# EAGLE design final (EAGLE 9.6.2)
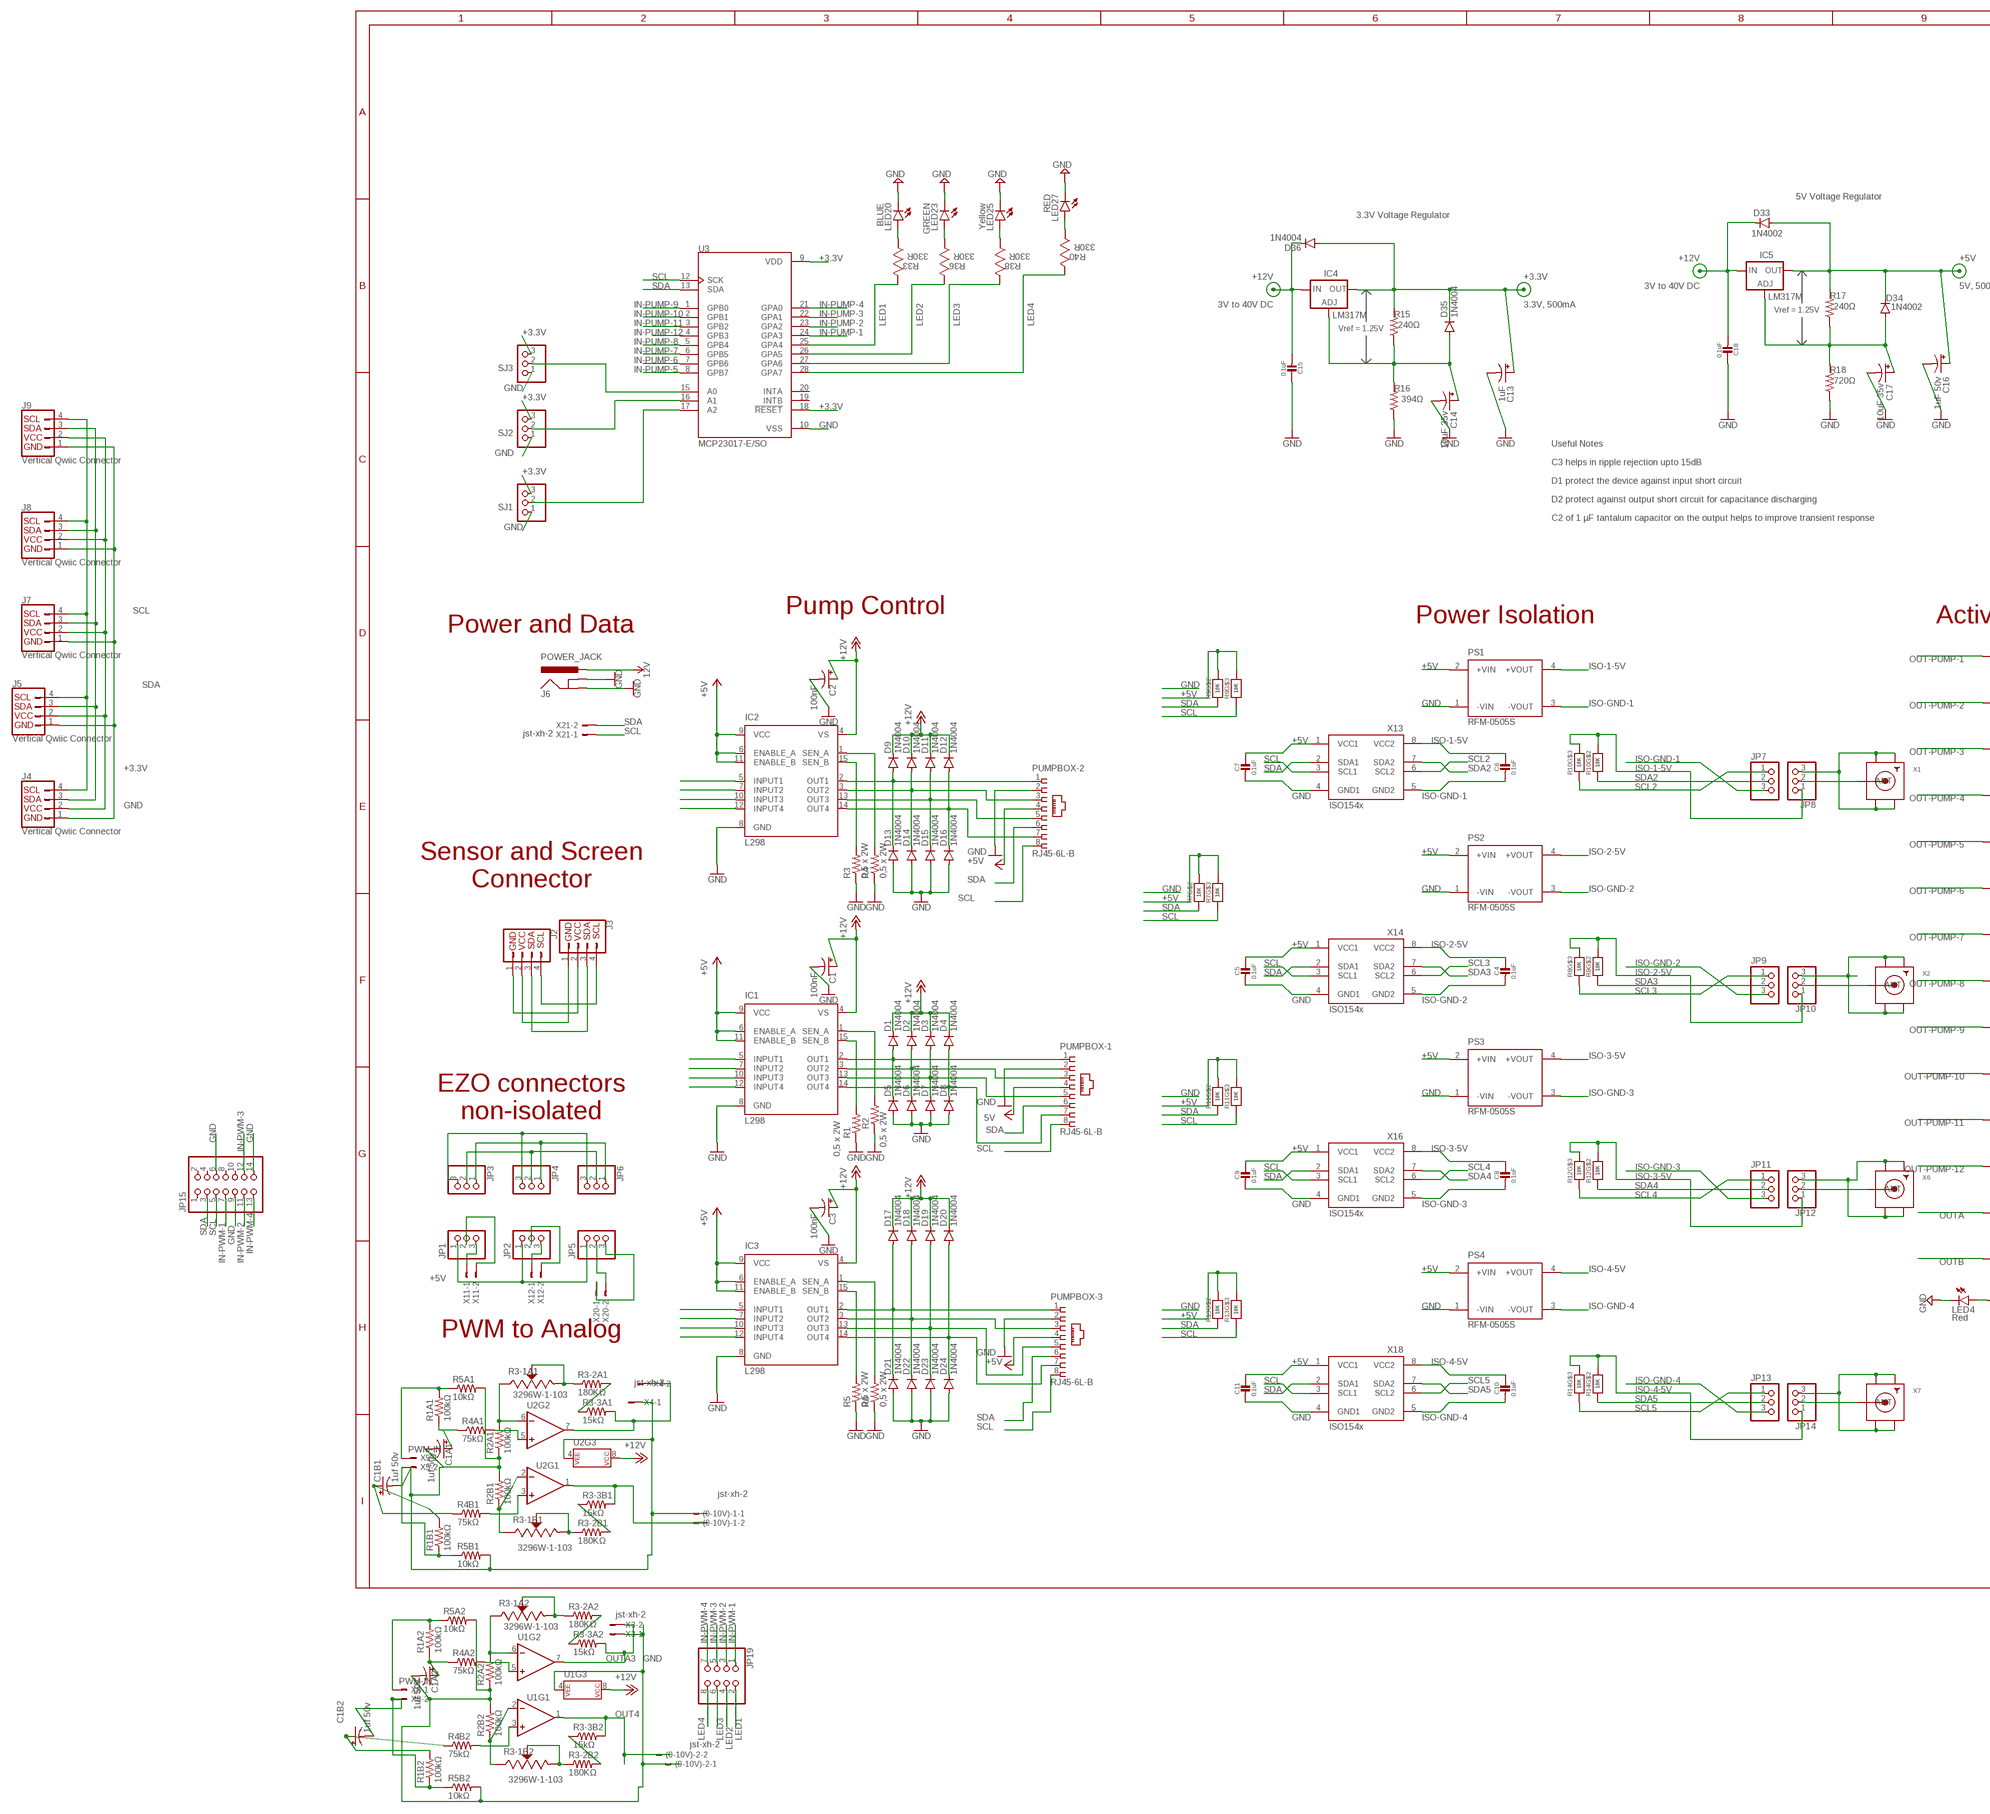
[diagram p0: schematic, sheet 1, part 1 of 2]
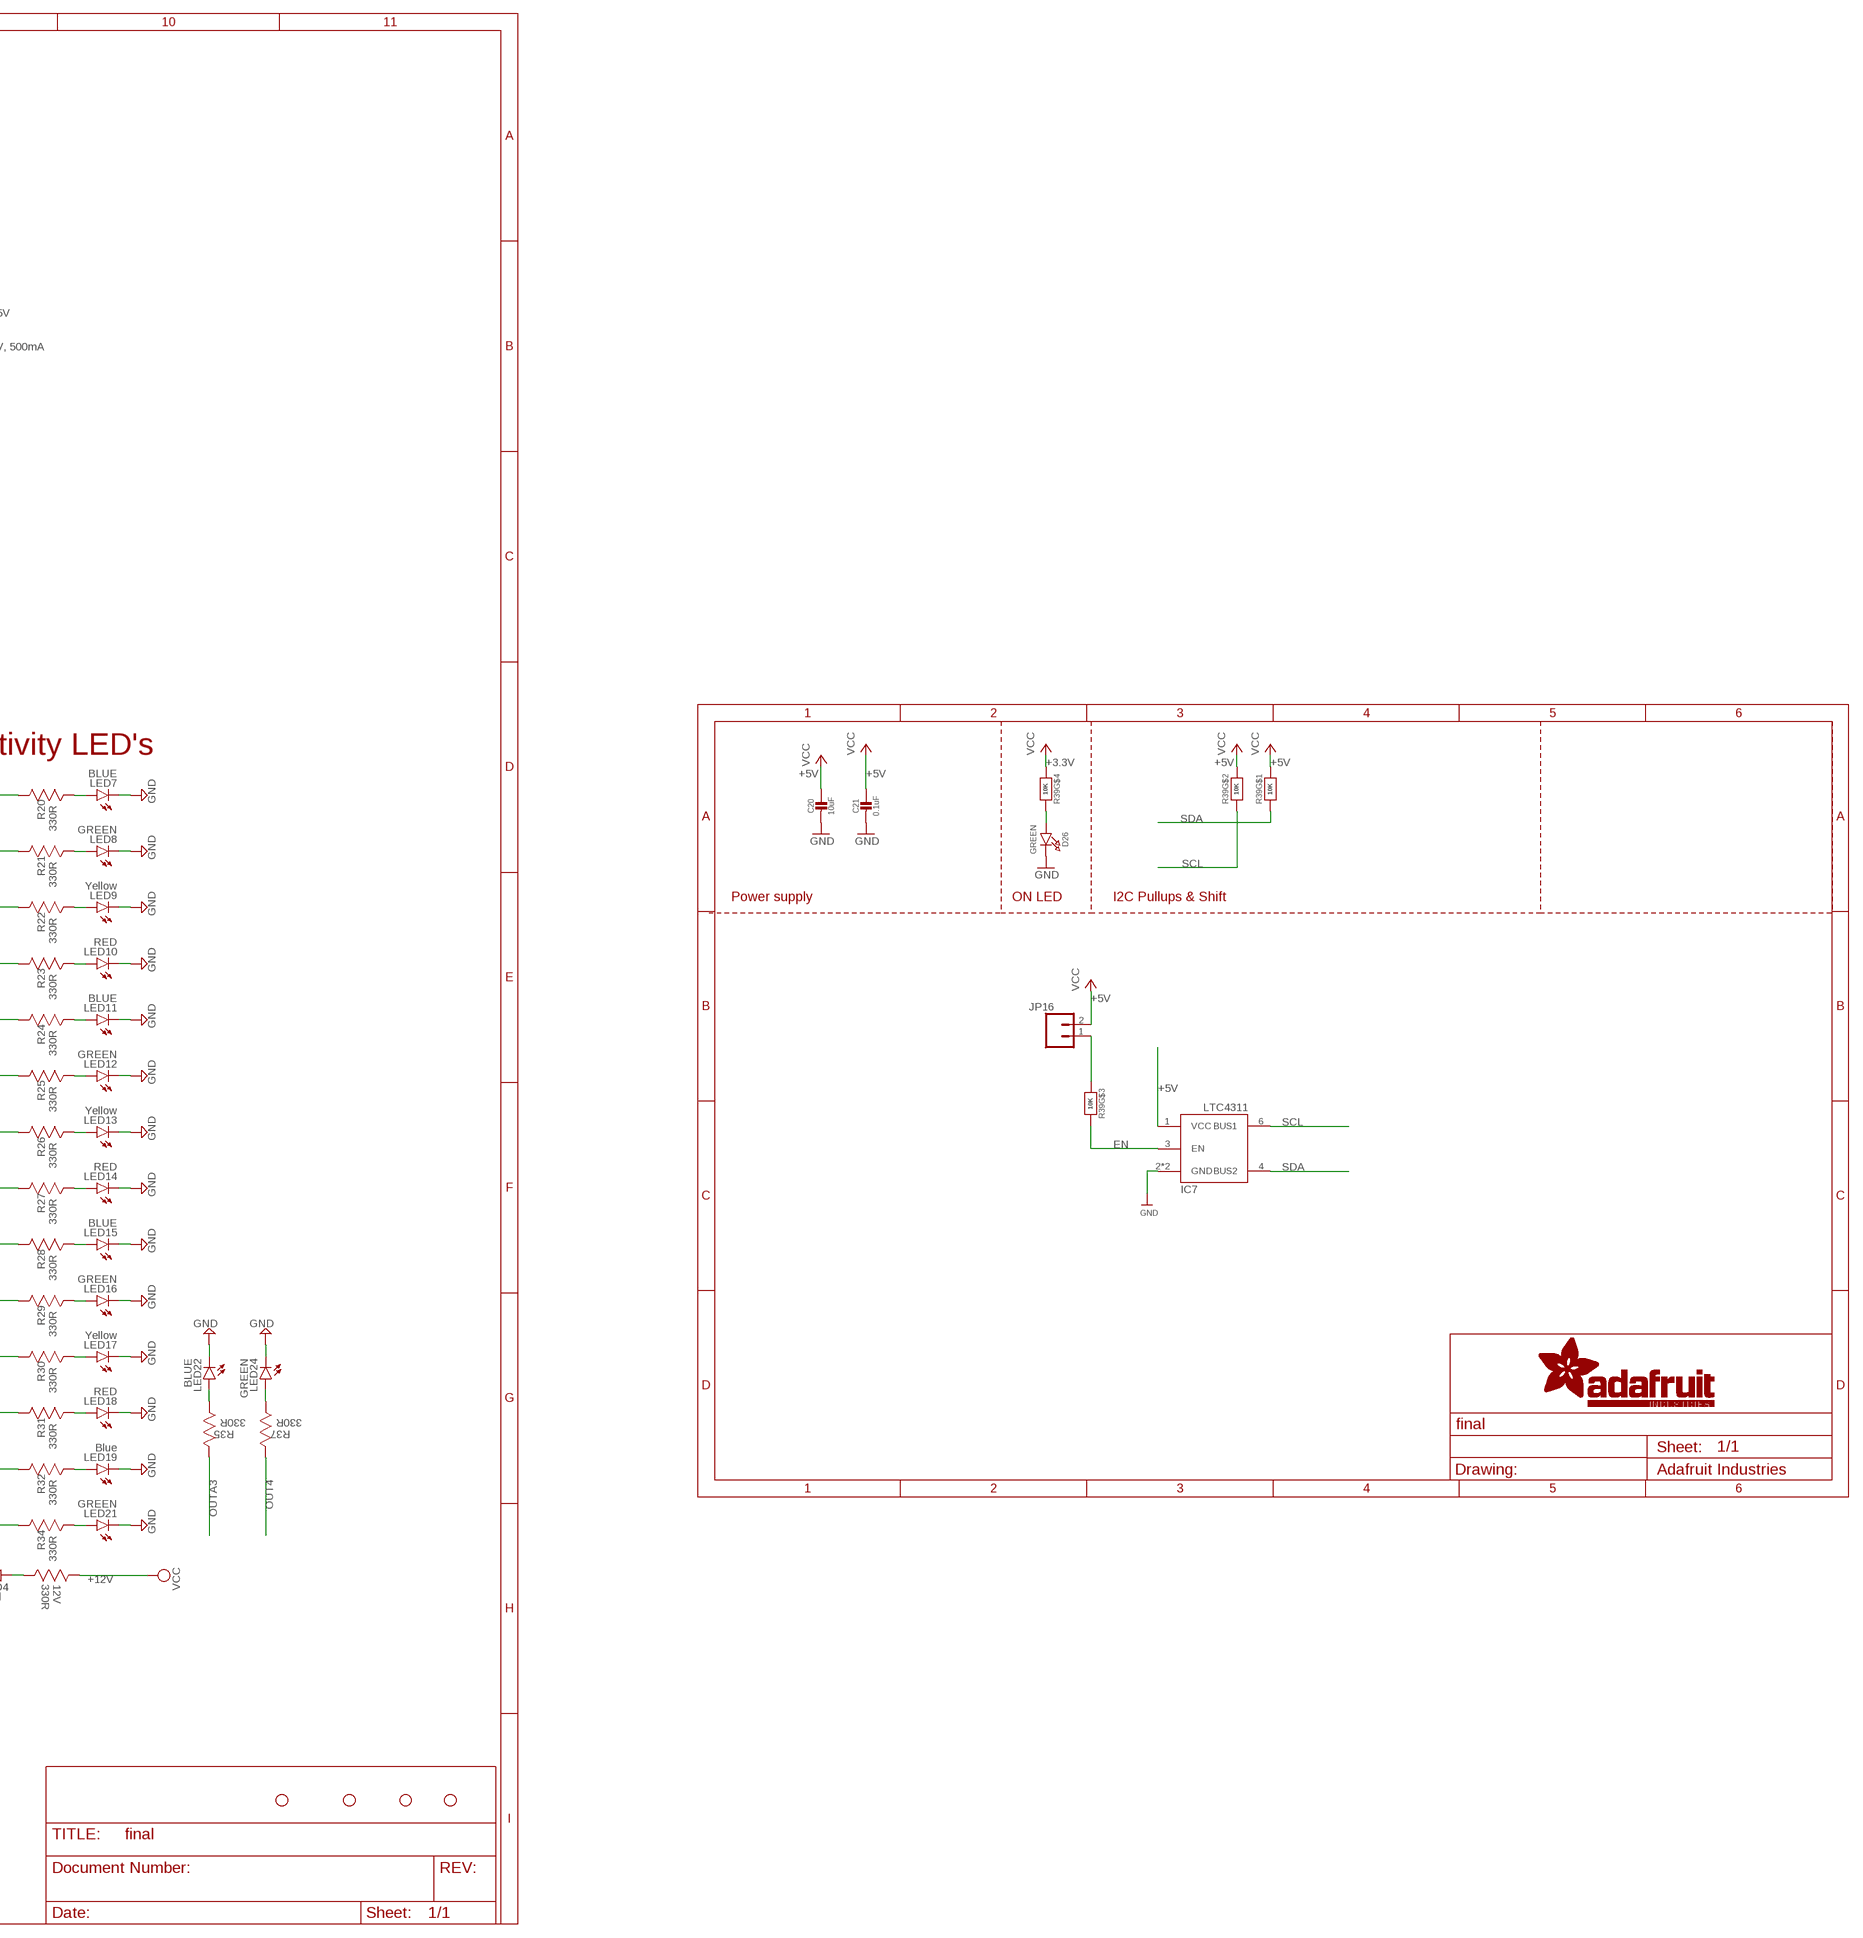
[diagram p1: schematic, sheet 1, part 2 of 2]

## Parts
12V  330R  MC0.063W06031%330R  [RESC1608X60N]
(0-10V)-1  jst-xh-2  JST-XH-02-PIN-LONG-PAD  [JST-XH-02-PACKAGE-LONG-PAD]
(0-10V)-2  jst-xh-2  JST-XH-02-PIN-LONG-PAD  [JST-XH-02-PACKAGE-LONG-PAD]
C1  100nF  CPOL-USUD-4X5,8  [UD-4X5,8_NICHICON]
C1A1  1uf 50v  CPOL-USUD-4X5,8  [UD-4X5,8_NICHICON]
C1A2  1uf 50v  CPOL-USUD-4X5,8  [UD-4X5,8_NICHICON]
C1B1  1uf 50v  CPOL-USUD-4X5,8  [UD-4X5,8_NICHICON]
C1B2  1uf 50v  CPOL-USUD-4X5,8  [UD-4X5,8_NICHICON]
C2  100nF  CPOL-USUD-4X5,8  [UD-4X5,8_NICHICON]
C3  100nF  CPOL-USUD-4X5,8  [UD-4X5,8_NICHICON]
C4  0.1uF  CAP_CERAMIC0603_NO  [0603-NO]
C5  0.1uF  CAP_CERAMIC0603_NO  [0603-NO]
C6  0.1uF  CAP_CERAMIC0603_NO  [0603-NO]
C7  0.1uF  CAP_CERAMIC0603_NO  [0603-NO]
C8  0.1uF  CAP_CERAMIC0603_NO  [0603-NO]
C9  0.1uF  CAP_CERAMIC0603_NO  [0603-NO]
C10  0.1uF  CAP_CERAMIC0603_NO  [0603-NO]
C11  0.1uF  CAP_CERAMIC0603_NO  [0603-NO]
C13  1uF  CPOL-USUD-4X5,8  [UD-4X5,8_NICHICON]
C14  10uF 35v  CPOL-USUD-4X5,8  [UD-4X5,8_NICHICON]
C15  0.1uF  CAP_CERAMIC0603_NO  [0603-NO]
C16  1uF 50v  CPOL-USUD-4X5,8  [UD-4X5,8_NICHICON]
C17  10uF 35v  CPOL-USUD-4X5,8  [UD-4X5,8_NICHICON]
C18  0.1uF  CAP_CERAMIC0603_NO  [0603-NO]
C20  10uF  CAP_CERAMIC0805-NOOUTLINE  [0805-NO]
C21  0.1uF  CAP_CERAMIC0603_NO  [0603-NO]
D1  1N4004  DIODE-DO214BA  [DO214BA]
D2  1N4004  DIODE-DO214BA  [DO214BA]
D3  1N4004  DIODE-DO214BA  [DO214BA]
D4  1N4004  DIODE-DO214BA  [DO214BA]
D5  1N4004  DIODE-DO214BA  [DO214BA]
D6  1N4004  DIODE-DO214BA  [DO214BA]
D7  1N4004  DIODE-DO214BA  [DO214BA]
D8  1N4004  DIODE-DO214BA  [DO214BA]
D9  1N4004  DIODE-DO214BA  [DO214BA]
D10  1N4004  DIODE-DO214BA  [DO214BA]
D11  1N4004  DIODE-DO214BA  [DO214BA]
D12  1N4004  DIODE-DO214BA  [DO214BA]
D13  1N4004  DIODE-DO214BA  [DO214BA]
D14  1N4004  DIODE-DO214BA  [DO214BA]
D15  1N4004  DIODE-DO214BA  [DO214BA]
D16  1N4004  DIODE-DO214BA  [DO214BA]
D17  1N4004  DIODE-DO214BA  [DO214BA]
D18  1N4004  DIODE-DO214BA  [DO214BA]
D19  1N4004  DIODE-DO214BA  [DO214BA]
D20  1N4004  DIODE-DO214BA  [DO214BA]
D21  1N4004  DIODE-DO214BA  [DO214BA]
D22  1N4004  DIODE-DO214BA  [DO214BA]
D23  1N4004  DIODE-DO214BA  [DO214BA]
D24  1N4004  DIODE-DO214BA  [DO214BA]
D26  GREEN  LED0603_NOOUTLINE  [CHIPLED_0603_NOOUTLINE]
D33  1N4002  DIODE-DO214BA  [DO214BA]
D34  1N4002  DIODE-DO214BA  [DO214BA]
D35  1N4004  DIODE-DO214BA  [DO214BA]
D36  1N4004  DIODE-DO214BA  [DO214BA]
H5  STAND-OFF  [STAND-OFF]
H6  STAND-OFF  [STAND-OFF]
H7  STAND-OFF  [STAND-OFF]
H8  STAND-OFF  [STAND-OFF]
IC1  L298  [MULTIWATT-15]
IC2  L298  [MULTIWATT-15]
IC3  L298  [MULTIWATT-15]
IC4  LM317MBSTT3  [SOT223]
IC5  LM317MBSTT3  [SOT223]
IC7  LTC4311_SC70  [SC70-6L]
J2  I2C_STANDARD  [1X04]
J3  I2C_STANDARD  [1X04]
J4  Vertical Qwiic Connector  QWIIC_CONNECTOR  [JST04_1MM_VERT]
J5  Vertical Qwiic Connector  QWIIC_CONNECTOR  [JST04_1MM_VERT]
J6  POWER_JACK  [POWER_JACK_PTH]
J7  Vertical Qwiic Connector  QWIIC_CONNECTOR  [JST04_1MM_VERT]
J8  Vertical Qwiic Connector  QWIIC_CONNECTOR  [JST04_1MM_VERT]
J9  Vertical Qwiic Connector  QWIIC_CONNECTOR  [JST04_1MM_VERT]
JP1  PINHD-1X3CB  [1X03-CLEANBIG]
JP2  PINHD-1X3CB  [1X03-CLEANBIG]
JP3  PINHD-1X3CB  [1X03-CLEANBIG]
JP4  PINHD-1X3CB  [1X03-CLEANBIG]
JP5  PINHD-1X3CB  [1X03-CLEANBIG]
JP6  PINHD-1X3CB  [1X03-CLEANBIG]
JP7  PINHD-1X3CB  [1X03-CLEANBIG]
JP8  PINHD-1X3CB  [1X03-CLEANBIG]
JP9  PINHD-1X3CB  [1X03-CLEANBIG]
JP10  PINHD-1X3CB  [1X03-CLEANBIG]
JP11  PINHD-1X3CB  [1X03-CLEANBIG]
JP12  PINHD-1X3CB  [1X03-CLEANBIG]
JP13  PINHD-1X3CB  [1X03-CLEANBIG]
JP14  PINHD-1X3CB  [1X03-CLEANBIG]
JP15  PINHD-2X7  [2X07]
JP16  CONN_02  [1X02]
JP19  PINHD-2X4  [2X04]
LED4  Red  LED-RED-0603-WE  [LED-0603]
LED7  BLUE  LED-BLUE0603  [LED-0603]
LED8  GREEN  LED-GREEN0603  [LED-0603]
LED9  Yellow  LED-YELLOW-0603-WE  [LED-0603]
LED10  RED  LED-RED0603  [LED-0603]
LED11  BLUE  LED-BLUE0603  [LED-0603]
LED12  GREEN  LED-GREEN0603  [LED-0603]
LED13  Yellow  LED-YELLOW0603  [LED-0603]
LED14  RED  LED-RED0603  [LED-0603]
LED15  BLUE  LED-BLUE0603  [LED-0603]
LED16  GREEN  LED-GREEN0603  [LED-0603]
LED17  Yellow  LED-YELLOW0603  [LED-0603]
LED18  RED  LED-RED0603  [LED-0603]
LED19  Blue  LED-BLUE-0603-WE  [LED-0603]
LED20  BLUE  LED-BLUE0603  [LED-0603]
LED21  GREEN  LED-GREEN0603  [LED-0603]
LED22  BLUE  LED-BLUE0603  [LED-0603]
LED23  GREEN  LED-GREEN0603  [LED-0603]
LED24  GREEN  LED-GREEN0603  [LED-0603]
LED25  Yellow  LED-YELLOW0603  [LED-0603]
LED27  RED  LED-RED0603  [LED-0603]
PS1  RFM-0505S  [CONV_RFM-0505S]
PS2  RFM-0505S  [CONV_RFM-0505S]
PS3  RFM-0505S  [CONV_RFM-0505S]
PS4  RFM-0505S  [CONV_RFM-0505S]
PUMPBOX-1  RJ45-6L-B  [RJ45-NO-SHIELD]
PUMPBOX-2  RJ45-6L-B  [RJ45-NO-SHIELD]
PUMPBOX-3  RJ45-6L-B  [RJ45-NO-SHIELD]
R1  0,5 x 2W  R-US_R2512  [R2512]
R1A1  100kΩ  R-US_M1206  [M1206]
R1A2  100kΩ  R-US_M1206  [M1206]
R1B1  100kΩ  R-US_M1206  [M1206]
R1B2  100kΩ  R-US_M1206  [M1206]
R2  0,5 x 2W  R-US_R2512  [R2512]
R2A1  100kΩ  R-US_M1206  [M1206]
R2A2  100kΩ  R-US_M1206  [M1206]
R2B1  100kΩ  R-US_M1206  [M1206]
R2B2  100kΩ  R-US_M1206  [M1206]
R3  0,5 x 2W  R-US_R2512  [R2512]
R3-1A1  3296W-1-103  [TRIM_3296W-1-103]
R3-1A2  3296W-1-103  [TRIM_3296W-1-103]
R3-1B1  3296W-1-103  [TRIM_3296W-1-103]
R3-1B2  3296W-1-103  [TRIM_3296W-1-103]
R3-2A1  180KΩ  R-US_M1206  [M1206]
R3-2A2  180KΩ  R-US_M1206  [M1206]
R3-2B1  180KΩ  R-US_M1206  [M1206]
R3-2B2  180KΩ  R-US_M1206  [M1206]
R3-3A1  15kΩ  R-US_M1206  [M1206]
R3-3A2  15kΩ  R-US_M1206  [M1206]
R3-3B1  15kΩ  R-US_M1206  [M1206]
R3-3B2  15kΩ  R-US_M1206  [M1206]
R4  0,5 x 2W  R-US_R2512  [R2512]
R4A1  75kΩ  R-US_M1206  [M1206]
R4A2  75kΩ  R-US_M1206  [M1206]
R4B1  75kΩ  R-US_M1206  [M1206]
R4B2  75kΩ  R-US_M1206  [M1206]
R5  0,5 x 2W  R-US_R2512  [R2512]
R5A1  10kΩ  R-US_M1206  [M1206]
R5A2  10kΩ  R-US_M1206  [M1206]
R5B1  10kΩ  R-US_M1206  [M1206]
R5B2  10kΩ  R-US_M1206  [M1206]
R6  0,5 x 2W  R-US_R2512  [R2512]
R7  10K  RESISTOR_4PACK  [RESPACK_4X0603]
R8  10K  RESISTOR_4PACK  [RESPACK_4X0603]
R9  10K  RESISTOR_4PACK  [RESPACK_4X0603]
R10  10K  RESISTOR_4PACK  [RESPACK_4X0603]
R11  10K  RESISTOR_4PACK  [RESPACK_4X0603]
R12  10K  RESISTOR_4PACK  [RESPACK_4X0603]
R13  10K  RESISTOR_4PACK  [RESPACK_4X0603]
R14  10K  RESISTOR_4PACK  [RESPACK_4X0603]
R15  240Ω  R-US_M0805  [M0805]
R16  394Ω  R-US_M0805  [M0805]
R17  240Ω  R-US_M0805  [M0805]
R18  720Ω  R-US_M0805  [M0805]
R20  330R  MC0.063W06031%330R  [RESC1608X60N]
R21  330R  MC0.063W06031%330R  [RESC1608X60N]
R22  330R  MC0.063W06031%330R  [RESC1608X60N]
R23  330R  MC0.063W06031%330R  [RESC1608X60N]
R24  330R  MC0.063W06031%330R  [RESC1608X60N]
R25  330R  MC0.063W06031%330R  [RESC1608X60N]
R26  330R  MC0.063W06031%330R  [RESC1608X60N]
R27  330R  MC0.063W06031%330R  [RESC1608X60N]
R28  330R  MC0.063W06031%330R  [RESC1608X60N]
R29  330R  MC0.063W06031%330R  [RESC1608X60N]
R30  330R  MC0.063W06031%330R  [RESC1608X60N]
R31  330R  MC0.063W06031%330R  [RESC1608X60N]
R32  330R  MC0.063W06031%330R  [RESC1608X60N]
R33  330R  MC0.063W06031%330R  [RESC1608X60N]
R34  330R  MC0.063W06031%330R  [RESC1608X60N]
R35  330R  MC0.063W06031%330R  [RESC1608X60N]
R36  330R  MC0.063W06031%330R  [RESC1608X60N]
R37  330R  MC0.063W06031%330R  [RESC1608X60N]
R38  330R  MC0.063W06031%330R  [RESC1608X60N]
R39  10K  RESISTOR_4PACK  [RESPACK_4X0603]
R40  330R  MC0.063W06031%330R  [RESC1608X60N]
SJ1  PINHD-1X3  [1X03]
SJ2  PINHD-1X3  [1X03]
SJ3  PINHD-1X3  [1X03]
U1  LM358  LM358SOI8  [SO08]
U2  LM358  LM358SOI8  [SO08]
U3  MCP23017-E/SO  [SOIC127P1030X265-28N]
X1  SMACONNECTOR_EDGE  [SMA_EDGELAUNCH]
X2  SMACONNECTOR_EDGE  [SMA_EDGELAUNCH]
X3  jst-xh-2  JST-XH-02-PIN-LONG-PAD  [JST-XH-02-PACKAGE-LONG-PAD]
X4  jst-xh-2  JST-XH-02-PIN-LONG-PAD  [JST-XH-02-PACKAGE-LONG-PAD]
X5  PWM-IN  JST-XH-02-PIN-LONG-PAD  [JST-XH-02-PACKAGE-LONG-PAD]
X6  SMACONNECTOR_EDGE  [SMA_EDGELAUNCH]
X7  SMACONNECTOR_EDGE  [SMA_EDGELAUNCH]
X8  PWM-IN  JST-XH-02-PIN-LONG-PAD  [JST-XH-02-PACKAGE-LONG-PAD]
X11  jst-xh-2  JST-XH-02-PIN-LONG-PAD  [JST-XH-02-PACKAGE-LONG-PAD]
X12  jst-xh-2  JST-XH-02-PIN-LONG-PAD  [JST-XH-02-PACKAGE-LONG-PAD]
X13  ISO154X  [SOIC8_150MIL]
X14  ISO154X  [SOIC8_150MIL]
X16  ISO154X  [SOIC8_150MIL]
X18  ISO154X  [SOIC8_150MIL]
X20  jst-xh-2  JST-XH-02-PIN-LONG-PAD  [JST-XH-02-PACKAGE-LONG-PAD]
X21  jst-xh-2  JST-XH-02-PIN-LONG-PAD  [JST-XH-02-PACKAGE-LONG-PAD]

## Nets
12V: J6.PWR
+3.3V [3.3v]: C13.+ D35.C D36.A IC4.4(OUT) J4.2 J5.2 J7.2 J8.2 J9.2 R15.2 R39.4 SJ1.3 SJ2.3 SJ3.3 U3.9(VDD) U3.18(!RESET) ; supply symbol labelled VCC
+5V [5v]: C5.1 C7.1 C9.1 C11.1 C16.+ C20.1 C21.1 D33.A D34.C IC1.6(ENABLE_A) IC1.9(VCC) IC1.11(ENABLE_B) IC2.6(ENABLE_A) IC2.9(VCC) IC2.11(ENABLE_B) IC3.6(ENABLE_A) IC3.9(VCC) IC3.11(ENABLE_B) IC5.4(OUT) IC7.1(VCC) J2.1 J3.2 JP1.1 JP2.1 JP5.1 JP16.2 PS1.2(+VIN) PS2.2(+VIN) PS3.2(+VIN) PS4.2(+VIN) PUMPBOX-1.4 PUMPBOX-2.4 PUMPBOX-3.4 R7.6 R7.7 R9.6 R9.7 R11.6 R11.7 R13.6 R13.7 R17.2 R39.7 R39.8 X13.1(VCC1) X14.1(VCC1) X16.1(VCC1) X18.1(VCC1) ; supply symbol labelled +3V3, VCC
+12V [12v]: 12V.1(R1) C1.+ C2.+ C3.+ C15.2 C18.2 D1.C D2.C D3.C D4.C D9.C D10.C D11.C D12.C D17.C D18.C D19.C D20.C D33.C D36.C IC1.4(VS) IC2.4(VS) IC3.4(VS) IC4.3(IN) IC5.3(IN) U1.8(P$V+) U2.8(P$V+) ; supply symbol labelled VCC
EN: IC7.3(EN) R39.6
GND: (0-10V)-1.1 (0-10V)-2.1 C1.- C1A1.- C1A2.- C1B1.- C2.- C3.- C5.2 C7.2 C9.2 C11.2 C13.- C14.- C15.1 C16.- C17.- C18.1 C20.2 C21.2 D5.A D6.A D7.A D8.A D13.A D14.A D15.A D16.A D21.A D22.A D23.A D24.A D26.C IC1.8(GND) IC2.8(GND) IC3.8(GND) IC7.2(GND) IC7.5(GND) J2.2 J3.1 J4.1 J5.1 J6.GND J6.GNDBREAK J7.1 J8.1 J9.1 JP3.3 JP4.3 JP6.3 JP15.6 JP15.9 JP15.14 LED4.C LED7.C LED8.C LED9.C LED10.C LED11.C LED12.C LED13.C LED14.C LED15.C LED16.C LED17.C LED18.C LED19.C LED20.C LED21.C LED22.C LED23.C LED24.C LED25.C LED27.C PS1.1(-VIN) PS2.1(-VIN) PS3.1(-VIN) PS4.1(-VIN) PUMPBOX-1.2 PUMPBOX-2.2 PUMPBOX-3.2 R1.1 R2.1 R2A1.1 R2A2.1 R2B1.2 R2B2.2 R3.1 R4.1 R5.1 R5A1.2 R5A2.2 R5B1.2 R5B2.2 R6.1 R16.1 R18.1 SJ1.1 SJ2.1 SJ3.1 U1.4(P$V-) U2.4(P$V-) U3.10(VSS) X3.1 X4.1 X13.4(GND1) X14.4(GND1) X16.4(GND1) X18.4(GND1)
IN-PUMP-1: IC1.5(INPUT1) U3.24(GPA3)
IN-PUMP-2: IC1.7(INPUT2) U3.23(GPA2)
IN-PUMP-3: IC1.10(INPUT3) U3.22(GPA1)
IN-PUMP-4: IC1.12(INPUT4) U3.21(GPA0)
IN-PUMP-5 [GPIO]: IC2.5(INPUT1) U3.8(GPB7)
IN-PUMP-6 [GPIO]: IC2.7(INPUT2) U3.7(GPB6)
IN-PUMP-7 [GPIO]: IC2.10(INPUT3) U3.6(GPB5)
IN-PUMP-8 [GPIO]: IC2.12(INPUT4) U3.5(GPB4)
IN-PUMP-9 [GPIO]: IC3.5(INPUT1) U3.1(GPB0)
IN-PUMP-10 [GPIO]: IC3.7(INPUT2) U3.2(GPB1)
IN-PUMP-11 [GPIO]: IC3.10(INPUT3) U3.3(GPB2)
IN-PUMP-12 [GPIO]: IC3.12(INPUT4) U3.4(GPB3)
IN-PWM-1: JP15.7 JP19.1 R1A1.2 R5A1.1 X5.1
IN-PWM-2: JP15.11 JP19.3 R1B1.1 R5B1.1 X5.2
IN-PWM-3: JP15.12 JP19.5 R1A2.2 R5A2.1 X8.1
IN-PWM-4: C1B2.- JP15.13 JP19.7 R1B2.1 R5B2.1 X8.2
ISO-1-5V: C6.1 JP8.1 PS1.4(+VOUT) R10.6 R10.7 X13.8(VCC2)
ISO-2-5V: C4.1 JP10.1 PS2.4(+VOUT) R8.6 R8.7 X14.8(VCC2)
ISO-3-5V: C8.1 JP12.1 PS3.4(+VOUT) R12.6 R12.7 X16.8(VCC2)
ISO-4-5V: C10.1 JP14.1 PS4.4(+VOUT) R14.6 R14.7 X18.8(VCC2)
ISO-GND-1: C6.2 JP7.3 PS1.3(-VOUT) X13.5(GND2)
ISO-GND-2: C4.2 JP9.3 PS2.3(-VOUT) X14.5(GND2)
ISO-GND-3: C8.2 JP11.3 PS3.3(-VOUT) X16.5(GND2)
ISO-GND-4: C10.2 JP13.3 PS4.3(-VOUT) X18.5(GND2)
LED1: JP19.2 R33.1(R1) U3.25(GPA4)
LED2: JP19.4 R36.1(R1) U3.26(GPA5)
LED3: JP19.6 R38.1(R1) U3.27(GPA6)
LED4: JP19.8 R40.1(R1) U3.28(GPA7)
N$1: IC2.1(SEN_A) R4.2
N$2: IC2.15(SEN_B) R3.2
N$3: IC3.1(SEN_A) R6.2
N$4: IC3.15(SEN_B) R5.2
N$5: C14.+ D35.A IC4.1(ADJ) R15.1 R16.2
N$6: R3-1B2.2(WIPER) R3-1B2.3(CW) R3-2B2.1
N$7: LED20.A R33.2(R2)
N$8: R3-2B2.2 R3-3B2.1
N$9: IC1.1(SEN_A) R2.2
N$10: IC1.15(SEN_B) R1.2
N$11: C17.+ D34.A IC5.1(ADJ) R17.1 R18.2
N$12: JP12.3 X6.GND@1(GND4) X6.GND@2(GND3) X6.GND@3(GND2) X6.GND@4(GND1)
N$13: LED23.A R36.2(R2)
N$14: JP8.3 X1.GND@1(GND4) X1.GND@2(GND3) X1.GND@3(GND2) X1.GND@4(GND1)
N$15: JP10.3 X2.GND@1(GND4) X2.GND@2(GND3) X2.GND@3(GND2) X2.GND@4(GND1)
N$16: JP8.2 X1.P(ANT)
N$17: R3-1B1.2(WIPER) R3-1B1.3(CW) R3-2B1.1
N$18: R3-2B1.2 R3-3B1.1
N$19: R3-1A1.2(WIPER) R3-1A1.3(CW) R3-2A1.1
N$20: R3-2A1.2 R3-3A1.1
N$21: C1A1.+ R1A1.1 R4A1.1
N$22: C1B1.+ R1B1.2 R4B1.1
N$23: R2A1.2 R3-1A1.1(CCW) U2.6(-IN)
N$24: R2B1.1 R3-1B1.1(CCW) U2.2(-IN)
N$25: R4A1.2 U2.5(+IN)
N$26: R4B1.2 U2.3(+IN)
N$27: C1B2.+ R1B2.2 R4B2.1
N$28: LED22.A R35.2(R2)
N$29: LED24.A R37.2(R2)
N$30: JP14.3 X7.GND@1(GND4) X7.GND@2(GND3) X7.GND@3(GND2) X7.GND@4(GND1)
N$31: JP5.2 X20.2
N$32: JP10.2 X2.P(ANT)
N$33: JP5.3 X20.1
N$34: JP2.3 X12.1
N$35: JP2.2 X12.2
N$36: JP12.2 X6.P(ANT)
N$37: JP1.3 X11.1
N$38: JP1.2 X11.2
N$40: JP14.2 X7.P(ANT)
N$41: D26.A R39.5
N$42: JP16.1 R39.3
N$47: 12V.2(R2) LED4.A
N$50 [GPIO]: LED7.A R20.2(R2)
N$51 [GPIO]: LED8.A R21.2(R2)
N$52 [GPIO]: LED9.A R22.2(R2)
N$53 [GPIO]: LED10.A R23.2(R2)
N$54 [GPIO]: LED11.A R24.2(R2)
N$55 [GPIO]: LED12.A R25.2(R2)
N$56 [GPIO]: LED13.A R26.2(R2)
N$57 [GPIO]: LED14.A R27.2(R2)
N$58 [GPIO]: LED15.A R28.2(R2)
N$59 [GPIO]: LED16.A R29.2(R2)
N$60 [GPIO]: LED17.A R30.2(R2)
N$61 [GPIO]: LED18.A R31.2(R2)
N$62 [GPIO]: LED19.A R32.2(R2)
N$63: R3-1A2.2(WIPER) R3-1A2.3(CW) R3-2A2.1
N$64 [GPIO]: LED21.A R34.2(R2)
N$65: LED25.A R38.2(R2)
N$66: R3-2A2.2 R3-3A2.1
N$67: LED27.A R40.2(R2)
N$68: C1A2.+ R1A2.1 R4A2.1
N$70: R2A2.2 R3-1A2.1(CCW) U1.6(-IN)
N$71: R2B2.1 R3-1B2.1(CCW) U1.2(-IN)
N$72: R4A2.2 U1.5(+IN)
N$73: R4B2.2 U1.3(+IN)
N$74: SJ3.2 U3.15(A0)
N$75: SJ2.2 U3.16(A1)
N$76: SJ1.2 U3.17(A2)
OUT4: (0-10V)-2.2 R3-3B2.2 R37.1(R1) U1.1(OUT)
OUT-PUMP-1 [highpower]: D1.A D5.C IC1.2(OUT1) PUMPBOX-1.1 R20.1(R1)
OUT-PUMP-2 [highpower]: D2.A D6.C IC1.3(OUT2) PUMPBOX-1.3 R21.1(R1)
OUT-PUMP-3 [highpower]: D3.A D7.C IC1.13(OUT3) PUMPBOX-1.5 R22.1(R1)
OUT-PUMP-4 [highpower]: D4.A D8.C IC1.14(OUT4) PUMPBOX-1.7 R23.1(R1)
OUT-PUMP-5 [highpower]: D9.A D13.C IC2.2(OUT1) PUMPBOX-2.1 R24.1(R1)
OUT-PUMP-6 [highpower]: D10.A D14.C IC2.3(OUT2) PUMPBOX-2.3 R25.1(R1)
OUT-PUMP-7 [highpower]: D11.A D15.C IC2.13(OUT3) PUMPBOX-2.5 R26.1(R1)
OUT-PUMP-8 [highpower]: D12.A D16.C IC2.14(OUT4) PUMPBOX-2.7 R27.1(R1)
OUT-PUMP-9 [highpower]: D17.A D21.C IC3.2(OUT1) PUMPBOX-3.1 R28.1(R1)
OUT-PUMP-10 [highpower]: D18.A D22.C IC3.3(OUT2) PUMPBOX-3.3 R29.1(R1)
OUT-PUMP-11 [highpower]: D19.A D23.C IC3.13(OUT3) PUMPBOX-3.5 R30.1(R1)
OUT-PUMP-12: D20.A D24.C IC3.14(OUT4) PUMPBOX-3.7 R31.1(R1)
OUTA: R3-3A1.2 R32.1(R1) U2.7(OUT) X4.2
OUTA3: R3-3A2.2 R35.1(R1) U1.7(OUT) X3.2
OUTB: (0-10V)-1.2 R3-3B1.2 R34.1(R1) U2.1(OUT)
SCL: IC7.6(BUS1) J2.3 J3.3 J4.4 J5.4 J7.4 J8.4 J9.4 JP3.1 JP4.1 JP6.1 JP15.5 PUMPBOX-1.8 PUMPBOX-2.8 PUMPBOX-3.8 R7.3 R9.3 R11.3 R13.3 R39.2 U3.12(SCK) X13.3(SCL1) X14.3(SCL1) X16.3(SCL1) X18.3(SCL1) X21.1
SCL2: JP7.1 R10.3 X13.6(SCL2)
SCL3: JP9.1 R8.3 X14.6(SCL2)
SCL4: JP11.1 R12.3 X16.6(SCL2)
SCL5: JP13.1 R14.3 X18.6(SCL2)
SDA: IC7.4(BUS2) J2.4 J3.4 J4.3 J5.3 J7.3 J8.3 J9.3 JP3.2 JP4.2 JP6.2 JP15.3 PUMPBOX-1.6 PUMPBOX-2.6 PUMPBOX-3.6 R7.2 R9.2 R11.2 R13.2 R39.1 U3.13(SDA) X13.2(SDA1) X14.2(SDA1) X16.2(SDA1) X18.2(SDA1) X21.2
SDA2: JP7.2 R10.2 X13.7(SDA2)
SDA3: JP9.2 R8.2 X14.7(SDA2)
SDA4: JP11.2 R12.2 X16.7(SDA2)
SDA5: JP13.2 R14.2 X18.7(SDA2)
Unconnected: JP15.1 JP15.2 JP15.4 JP15.8 JP15.10 R7.1 R7.4 R7.5 R7.8 R8.1 R8.4 R8.5 R8.8 R9.1 R9.4 R9.5 R9.8 R10.1 R10.4 R10.5 R10.8 R11.1 R11.4 R11.5 R11.8 R12.1 R12.4 R12.5 R12.8 R13.1 R13.4 R13.5 R13.8 R14.1 R14.4 R14.5 R14.8 U3.19(INTB) U3.20(INTA)

## Notes on the sheet
- 5V Voltage Regulator
- 3.3V Voltage Regulator
- 3V to 40V DC | 5V, 500mA
- 3V to 40V DC | 3.3V, 500mA
- Vref = 1.25V
- Vref = 1.25V
- Useful Notes
- C3 helps in ripple rejection upto 15dB
- D1 protect the device against input short circuit
- D2 protect against output short circuit for capacitance discharging
- C2 of 1 µF tantalum capacitor on the output helps to improve transient response
- Pump Control
- Power Isolation | Activity LED's
- Power and Data
- Power supply | ON LED | I2C Pullups & Shift
- Sensor and Screen
  Connector
- EZO connectors
  non-isolated
- PWM to Analog

## Library data of the parts
12V R20-R38 R40 = Multicomp:MC0.063W06031%330R: RESISTOR, 0603; MPN: MC0.063W06031%330R; OC_FARNELL: 9331018; OC_NEWARK: -; SUPPLIER: Multicomp; TOLERANCE: ±1%; VALUE: 330 Ohms; WATTAGE: 1/16 W
(0-10V)-1 (0-10V)-2 X3-X5 X8 X11 X12 X20 X21 = Rembrandt Electronics - JST XH Connectors v1-0:JST-XH-02-PIN: JST XH Connector 2 Pin Wire to board connector. Pitch: 2,54 mm, (0.100") Number of pins: 2 Created by Rembrandt Electronics www.rembrandtelectronics.com
C1 C1A1 C1A2 C1B1 C1B2 C2 C3 C13 C14 C16 C17 = rcl:CPOL-US: POLARIZED CAPACITOR, American symbol; SPICEPREFIX: C
C4-C11 C15 C18 C20 C21 = microbuilder:CAP_CERAMIC: Ceramic Capacitors For new designs, use the packages preceded by an '_' character since they are more reliable: The following footprints should be used on most boards: _0402 - Standard footprint for regular board layouts _0603 - Standard footprint for regular board layouts _0805 - Standard footprint for regular board layouts _1206 - Standard footprint for regular board layouts For extremely tight-pitch boards where space is at a premium, the following 'micro-pitch' footprints can be used (smaller pads, no silkscreen outline, etc.): _0402MP - Micro-pitch footprint for very dense/compact boards _0603MP - Micro-pitch footprint for very dense/compact boards _0805MP - Micro-pitch footprint for very dense/compact boards _1206MP - Micro-pitch footprint for very dense/compact boards
D1-D24 D33-D36 = diode:DIODE-: DIODE
D26 = microbuilder:LED: LED 0603 - 0603 Surface Mount Package 2mA: Green LED - Low Power (3.9mcd, 2ma, 1.7Vf) - Digikey: 475-2709-2-ND Orange LED - Low Power (9.8mcd, 2ma, 1.8Vf) - Digikey: 475-1194-2-ND Red LED - Low Power (5mcd, 2ma, 1.8Vf) - Digikey: 475-1195-2-ND Yellow LED - Low Power (7mcd, 2ma, 1.8Vf) - Digikey: 475-1196-2-ND 5mA: Blue LED - Low Power (17mcd, 5ma, 2.9Vf) - Digikey: LNJ937W8CRACT-ND 0805 - 0805 Surface Mount Package 2mA: Red LED (8.8mcd, 2mA, 1.8Vf, Clear) - Low Power [Digikey: 475-2510-1-ND] Green LED (5mcd, 2mA, 1.8Vf, Clear) - Low Power [Digikey: 475-2730-1-ND] Yellow LED (11.3mcd, 2mA, 1.8Vf, Clear) - Low Power [Digikey: 475-2555-1-ND] 20mA: Red LED (104mcd, 20mA, Diffused) - LS R976 [Digikey: 475-1278-6-ND] Red LED (12mcd, 20mA, 2.0Vf, Clear) - APT2012EC [Digikey: 754-1128-1-ND] Green LED (15mcd, 20mA, 2.2Vf, Clear) - APT2012GC [Digikey: 754-1131-1-ND] Orange LED (160mcd, 20mA, 2.1Vf, Clear) - APT2012SECK [Digikey: 754-1130-1-ND] 1206 - 1206 Surface Mount Package Green LED (26mcd, 20mA, Diffused) - LG N971 [Digikey: 475-1407-6-ND] Red LED (15mcd, 20mA, Diffused) - LH N974 [Digikey: 475-1416-6-ND] Cree - Cree High-Power Surface Mount LEDs XPEBWT-L1-0000-00D50 - White 111lm 350mA 2.9Vf 6200K 110° XTEAWT-00-0000-00000LEE3 - White 114lm 350mA 2.85Vf 5000K 115° Everlight - Everlight 45-21 Series Surface Mount LEDs 45-21/QK2C-B2832AC2CB2/2T - Warm White 2000mcd 20mA 3.25Vf 3050K 120° 45-21/LK2C-B38452C4CB2/2T - Nuetral White 2000mcd 20mA 3.25Vf 4150K 120° 45-21/LK2C-B50634C6CB2/2T - Cold White 2200mcd 20mA 3.25Vf 5650K 120° PLCC2 Reverse Mount LS T77K-J1L2-1-0-2-R18-Z - Red 11.25mcd 2mA 1.8Vf 630nm 120° LO T77K-L1M2-24-Z - Orange 19.6mcd 2mA 1.8Vf 606nm 120° LY T77K-K2M1-26-Z - Yellow 15.7mcd 2mA 1.8Vf 587nm 120°
H5-H8 = SparkFun-Hardware:STAND-OFF: Stand Off Drill holes for mechanically mounting via screws, standoffs, etc. Note: Use the keepout ring to avoid running the screw head into surrounding components. Variant Overviews STAND-OFF - Mechanical footprint for a #4 phillips button head screw. STAND-OFF-TIGHT - Mechanical footprint for a #4 phillips button head screw, Example SparkFun Products Screw - Phillips Head (1/4", 4-40, 10 pack) <https://www.sparkfun.com/products/10453> (PRT-10453) Screw - Phillips Head (1/2", 4-40, 10 pack) <https://www.sparkfun.com/products/10452> (PRT-10452) Screw - Phillips Head (3/4", 4-40, 10 pack) <https://www.sparkfun.com/products/10451> (PRT-10451) Screw - Phillips Head (1", 4-40, 10 pack) <https://www.sparkfun.com/products/10450> (PRT-10450)
IC1-IC3 = st-microelectronics:L298: DUAL FULL-BRIDGE DRIVER
IC4 IC5 = v-reg:LM317?*: 500 mA Adjustable Output Positive Voltage Regulator Source: http://www.onsemi.co.jp .. LM317M-D.PDF; PARTNUMBER: LM317M
IC7 = microbuilder:LTC4311
J2 J3 = SparkFun-Connectors:I2C_STANDARD: SparkFun I2C Standard Pinout Header SparkFun has standardized on a pinout for all I2C based sensor breakouts. This pinout allows I2C boards to be plugged directly into the headers on Arduino Uno compatible boards, and to be daisy chained easily. Example SparkFun Products: SparkFun Atmospheric Sensor Breakout - BME280 <https://www.sparkfun.com/products/13676> SparkFun Altitude/Pressure Sensor Breakout - MPL3115A2 <https://www.sparkfun.com/products/11084> SparkFun TOF Range Finder Sensor - VL6180 <https://www.sparkfun.com/products/12785>
J4 J5 J7-J9 = SparkFun-Connectors:QWIIC_CONNECTOR: SparkFun I2C Standard Qwiic Connector An SMD 1mm pitch JST connector makes it easy and quick (get it? Qwiic?) to connect I2C devices to each other. The Qwiic system <http://www.sparkfun.com/qwiic> enables fast and solderless connection between popular platforms and various sensors and actuators. We carry 200mm <https://www.sparkfun.com/products/14204>, 100mm <https://www.sparkfun.com/products/14205>, 50mm <https://www.sparkfun.com/products/14206>, and breadboard friendly <https://www.sparkfun.com/products/14207> Qwiic cables. We also offer 10 pcs strips <https://www.sparkfun.com/products/14323> the SMD connectors.; PROD_ID: CONN-14483
J6 = SparkFun-Connectors:POWER_JACK: Power Jack Connector This is the standard 5.5mm barrel jack for power. The PTH is the most common, proven, reliable, footprint. The Slot footprint only works if the mill layer is transmitted to the PCB fab house so be warned. Here are the connectors we sell at SparkFun: DC Barrel Power Jack/Connector <https://www.sparkfun.com/products/119> (PRT-00119) DC Barrel Power Jack/Connector (SMD) <https://www.sparkfun.com/products/12748> (PRT-12748) DC Barrel Jack Adapter - Breadboard Compatible <https://www.sparkfun.com/products/10811> (PRT-10811) It is used on this SparkFun product (and many, many others): SparkFun RedBoard - Programmed with Arduino <https://www.sparkfun.com/products/12757> (DEV-12757) Also, if you need a mating power supply or connector, please check these out: Wall Adapter Power Supply - 9VDC 650mA <https://www.sparkfun.com/products/298> (TOL-00298) DC Barrel Jack Adapter - Male <https://www.sparkfun.com/products/10287> (PRT-10287); PROD_ID: CONN-08197
JP1-JP14 SJ1-SJ3 = adafruit:PINHD-1X3: PIN HEADER
JP15 = pinhead:PINHD-2X7: PIN HEADER
JP16 = SparkFun-Connectors:CONN_02: Multi connection point. Often used as Generic Header-pin footprint for 0.1 inch spaced/style header connections On any of the 0.1 inch spaced packages, you can populate with these: Break Away Headers - Straight <https://www.sparkfun.com/products/116> (PRT-00116) Break Away Male Headers - Right Angle <https://www.sparkfun.com/products/553> (PRT-00553) Female Headers <https://www.sparkfun.com/products/115> (PRT-00115) Break Away Headers - Machine Pin <https://www.sparkfun.com/products/117> (PRT-00117) Break Away Female Headers - Swiss Machine Pin <https://www.sparkfun.com/products/743> (PRT-00743) For SCREWTERMINALS and SPRING TERMINALS visit here: Screw Terimnals on SparkFun.com <https://www.sparkfun.com/search/results?term=Screw+Terminals> (5mm/3.5mm/2.54mm spacing) This device is also useful as a general connection point to wire up your design to another part of your project. Our various solder wires solder well into these plated through hole pads. Hook-Up Wire - Assortment (Stranded, 22 AWG) <https://www.sparkfun.com/products/11375> (PRT-11375) Hook-Up Wire - Assortment (Solid Core, 22 AWG) <https://www.sparkfun.com/products/11367> (PRT-11367) View the entire wire category on our website here <https://www.sparkfun.com/categories/141> Special notes: Molex polarized connector foot print use with: PRT-08233 with associated crimp pins and housings. 2.54_SCREWTERM for use with PRT-10571. 3.5mm Screw Terminal footprints for PRT-08084 5mm Screw Terminal footprints for use with PRT-08432
JP19 = pinhead:PINHD-2X4: PIN HEADER
LED4 = SparkFun-LED:LED-RED: Red SMD LED Used in manufacturing of most products at SparkFun Packages: 0603 - SMD 0603 package [Product Link] <http://docs.avagotech.com/docs/AV02-0551EN> 0603 SMART - SMD 0603 SMART package ( more efficient and expensive)[Product Link] <http://www.osram-os.com/Graphics/XPic2/00077099_0.pdf> 1206 - SMD1206 package [Product Link] <https://www.sparkfun.com/datasheets/DevTools/LilyPad/Q150OVS4.pdff> SparkFun Products: Pro Mini 328 -5V <https://www.sparkfun.com/products/821> RedBoard <https://www.sparkfun.com/products/12757> IOIO-OTG <https://www.sparkfun.com/products/13613>; PROD_ID: DIO-16511
LED7 LED11 LED15 LED20 LED22 = SparkFun-LED:LED-BLUE: Blue SMD LED Used in manufacturing of various products at SparkFun Packages: 0603 - SMD 0603 package [Product Link] <http://www.digikey.com/product-detail/en/SMLE12BC7TT86/511-1589-2-ND/1641808> 1206 - SMD1206 package [Product Link] <http://www.digikey.com/product-detail/en/lite-on-inc/LTST-C150TBKT/160-1643-1-ND/573584> SparkFun Products: ESP8266 Thing-Dev Board <https://www.sparkfun.com/products/13711> RedBoard <https://www.sparkfun.com/products/12757>; PROD_ID: DIO-08575
LED8 LED12 LED16 LED21 LED23 LED24 = SparkFun-LED:LED-GREEN: Green SMD LED Used in manufacturing of various products at SparkFun Packages: 0603 - SMD 0603 package [Product Link] <http://www.futureelectronics.com/en/technologies/semiconductors/optoelectronics/leds/Pages/9894312-LTST-C190GKT.aspx?CrossPart=HSMG-C190&IM=0> LilyPad 1206 - SMD1206 LilyPad package [Product Link] <http://www.futureelectronics.com/en/Technologies/Product.aspx?ProductID=IN150NGHARVATEKCORPORATION2049943&IM=0> 1206 - SMD1206 package [Product Link] <http://www.futureelectronics.com/en/technologies/semiconductors/optoelectronics/leds/Pages/8315665-LTST-C150KGKT.aspx?IM=0> 1206 Bottom Mount -SMD 1206 Bottom Mount [Product Link] <http://www.digikey.com/product-detail/en/lite-on-inc/LTST-C230KGKT/160-1456-1-ND/386854> SparkFun Products: Pro Mini 328 -5V <https://www.sparkfun.com/products/821> RedBoard <https://www.sparkfun.com/products/12757> MP3 Trigger <https://www.sparkfun.com/products/13720> Makey Makey <https://www.sparkfun.com/products/11076>; PROD_ID: DIO-00821
LED9 = SparkFun-LED:LED-YELLOW: Yellow SMD LED Used in manufacturing several products at SparkFun. Packages: 0603 - SMD 0603 package[Product Link] <http://www.kingbrightusa.com/product.asp?catalog_name=LED&product_id=APT1608SYCK> 0603 -SMART - SMART SMD 0603 package (more efficient/more expensive) [Product Link] <http://www.osram-os.com/osram_os/en/products/product-catalog/led-light-emitting-diodes/smartled-0603/ly-l29k/index.jsp> LilyPad - SMD1206 package[Product Datasheet] <https://www.sparkfun.com/datasheets/DevTools/LilyPad/Q150YUS4.pdf> SparkFun Products: Blynk Board <https://www.sparkfun.com/products/13794> IOIO-OTG <https://www.sparkfun.com/products/13613> XBee Explorer Serial <https://www.sparkfun.com/products/13225>; PROD_ID: DIO-16514
LED10 LED14 LED18 LED27 = SparkFun-LED:LED-RED: Red SMD LED Used in manufacturing of most products at SparkFun Packages: 0603 - SMD 0603 package [Product Link] <http://docs.avagotech.com/docs/AV02-0551EN> 0603 SMART - SMD 0603 SMART package ( more efficient and expensive)[Product Link] <http://www.osram-os.com/Graphics/XPic2/00077099_0.pdf> 1206 - SMD1206 package [Product Link] <https://www.sparkfun.com/datasheets/DevTools/LilyPad/Q150OVS4.pdff> SparkFun Products: Pro Mini 328 -5V <https://www.sparkfun.com/products/821> RedBoard <https://www.sparkfun.com/products/12757> IOIO-OTG <https://www.sparkfun.com/products/13613>; PROD_ID: DIO-00819
LED13 LED17 LED25 = SparkFun-LED:LED-YELLOW: Yellow SMD LED Used in manufacturing several products at SparkFun. Packages: 0603 - SMD 0603 package[Product Link] <http://www.kingbrightusa.com/product.asp?catalog_name=LED&product_id=APT1608SYCK> 0603 -SMART - SMART SMD 0603 package (more efficient/more expensive) [Product Link] <http://www.osram-os.com/osram_os/en/products/product-catalog/led-light-emitting-diodes/smartled-0603/ly-l29k/index.jsp> LilyPad - SMD1206 package[Product Datasheet] <https://www.sparkfun.com/datasheets/DevTools/LilyPad/Q150YUS4.pdf> SparkFun Products: Blynk Board <https://www.sparkfun.com/products/13794> IOIO-OTG <https://www.sparkfun.com/products/13613> XBee Explorer Serial <https://www.sparkfun.com/products/13225>; PROD_ID: DIO-09003
LED19 = SparkFun-LED:LED-BLUE: Blue SMD LED Used in manufacturing of various products at SparkFun Packages: 0603 - SMD 0603 package [Product Link] <http://www.digikey.com/product-detail/en/SMLE12BC7TT86/511-1589-2-ND/1641808> 1206 - SMD1206 package [Product Link] <http://www.digikey.com/product-detail/en/lite-on-inc/LTST-C150TBKT/160-1643-1-ND/573584> SparkFun Products: ESP8266 Thing-Dev Board <https://www.sparkfun.com/products/13711> RedBoard <https://www.sparkfun.com/products/12757>; PROD_ID: DIO-16513
PS1-PS4 = RFM-0505S:RFM-0505S: DC/DC Converter, 1 Watt, SIP4, Single Output Check availability <https://pricing.snapeda.com/parts/RFM-0505S/Recom%20Power/view-part?ref=eda>; AVAILABILITY: In Stock; DESCRIPTION: 1W DC/DC-Converter 'ECONOLINE' SIP4 1kV unreg; MF: Recom Power; MP: RFM-0505S; PACKAGE: SIP-4 Recom Power; PRICE: None; PURCHASE-URL: https://pricing.snapeda.com/search/part/RFM-0505S/?ref=eda
PUMPBOX-1-PUMPBOX-3 = con-tycoelectronics:RJ45: CORCOM Modular RJ Jacks No Shield Source: www.tycoelectronics.com .. ENG_DS_1654001_1099_RJ_L_0507.pdf; MPN: RJ45-6L-B; OC_FARNELL: unknown; OC_NEWARK: 16R6090
R1 R1A1 R1A2 R1B1 R1B2 R2 R2A1 R2A2 R2B1 R2B2 R3 R3-2A1 R3-2A2 R3-2B1 R3-2B2 R3-3A1 R3-3A2 R3-3B1 R3-3B2 R4 R4A1 R4A2 R4B1 R4B2 R5 R5A1 R5A2 R5B1 R5B2 R6 = adafruit:R-US_: RESISTOR, American symbol
R3-1A1 R3-1A2 R3-1B1 R3-1B2 = 3296W-1-103:3296W-1-103: Res Cermet Trimmer 500K Ohm 10% 0.5W 25(Elec)Turn 2.19mm (9.53 X 4.83 X 11.55mm) Pin Thru-Hole Tube Check availability <https://pricing.snapeda.com/parts/3296W-1-103/Bourns/view-part?ref=eda>; AVAILABILITY: In Stock; DESCRIPTION: 10 kOhms 0.5W, 1/2W PC Pins Through Hole Trimmer Potentiometer Cermet 25.0 Turn Top Adjustment; MF: Bourns; MP: 3296W-1-103; PACKAGE: SOT-23-5 Bourns; PRICE: None; PURCHASE-URL: https://pricing.snapeda.com/search/part/3296W-1-103/?ref=eda
R7-R14 R39 = microbuilder:RESISTOR_4PACK: Resistor Packs (4 resistors) 4 x 0603 10K 1/16W - Digikey: YC164J-10KCT-ND
R15-R18 = resistor:R-US_: RESISTOR, American symbol
U1 U2 = SparkFun-IC-Amplifiers:LM358: LM358 Jellybean op-amp Datasheet <http://www.sparkfun.com/datasheets/Components/General/LM358.pdf> SparkFun Products Op-Amp (Thru-Hole) - LM358 <https://www.sparkfun.com/products/9456> (COM-09456)
U3 = MCP23017-E_SO:MCP23017-E/SO: MCP23017 Series 5.5 V 1.7 MHz SMT 16-Bit I2C I/O Expander - SOIC-28 Check availability <https://pricing.snapeda.com/parts/MCP23017-E/SO/Microchip/view-part?ref=eda>; AVAILABILITY: In Stock; DESCRIPTION: I/O Expander 16 I²C 1.7 MHz 28-SOIC; MF: Microchip; MP: MCP23017-E/SO; PACKAGE: SOIC-28 Microchip; PRICE: None; PURCHASE-URL: https://pricing.snapeda.com/search/part/MCP23017-E/SO/?ref=eda
X1 X2 X6 X7 = adafruit@1:SMACONNECTOR: SMA Connector 90° DIP SMA Connector, 50 Ohm (4UConnector: 07259)
X13 X14 X16 X18 = adafruit_power:ISO154X

## Net classes
0 default: width 0.356 mm, drill 0.102 mm, clearance 0.254 mm
1 highpower: width 0.356 mm, drill 0.356 mm
2 12v: width 0.457 mm, drill 0.102 mm, clearance 0.254 mm
3 5v: width 0.406 mm, drill 0.102 mm, clearance 0.254 mm
4 3.3v: width 0.406 mm, drill 0.102 mm, clearance 0.254 mm
5 i2c: width 0.356 mm, drill 0.102 mm, clearance 0.254 mm
6 GPIO: width 0.356 mm, drill 0.102 mm, clearance 0.254 mm
8 New Class: drill 0.102 mm, clearance 0.152 mm

## Board
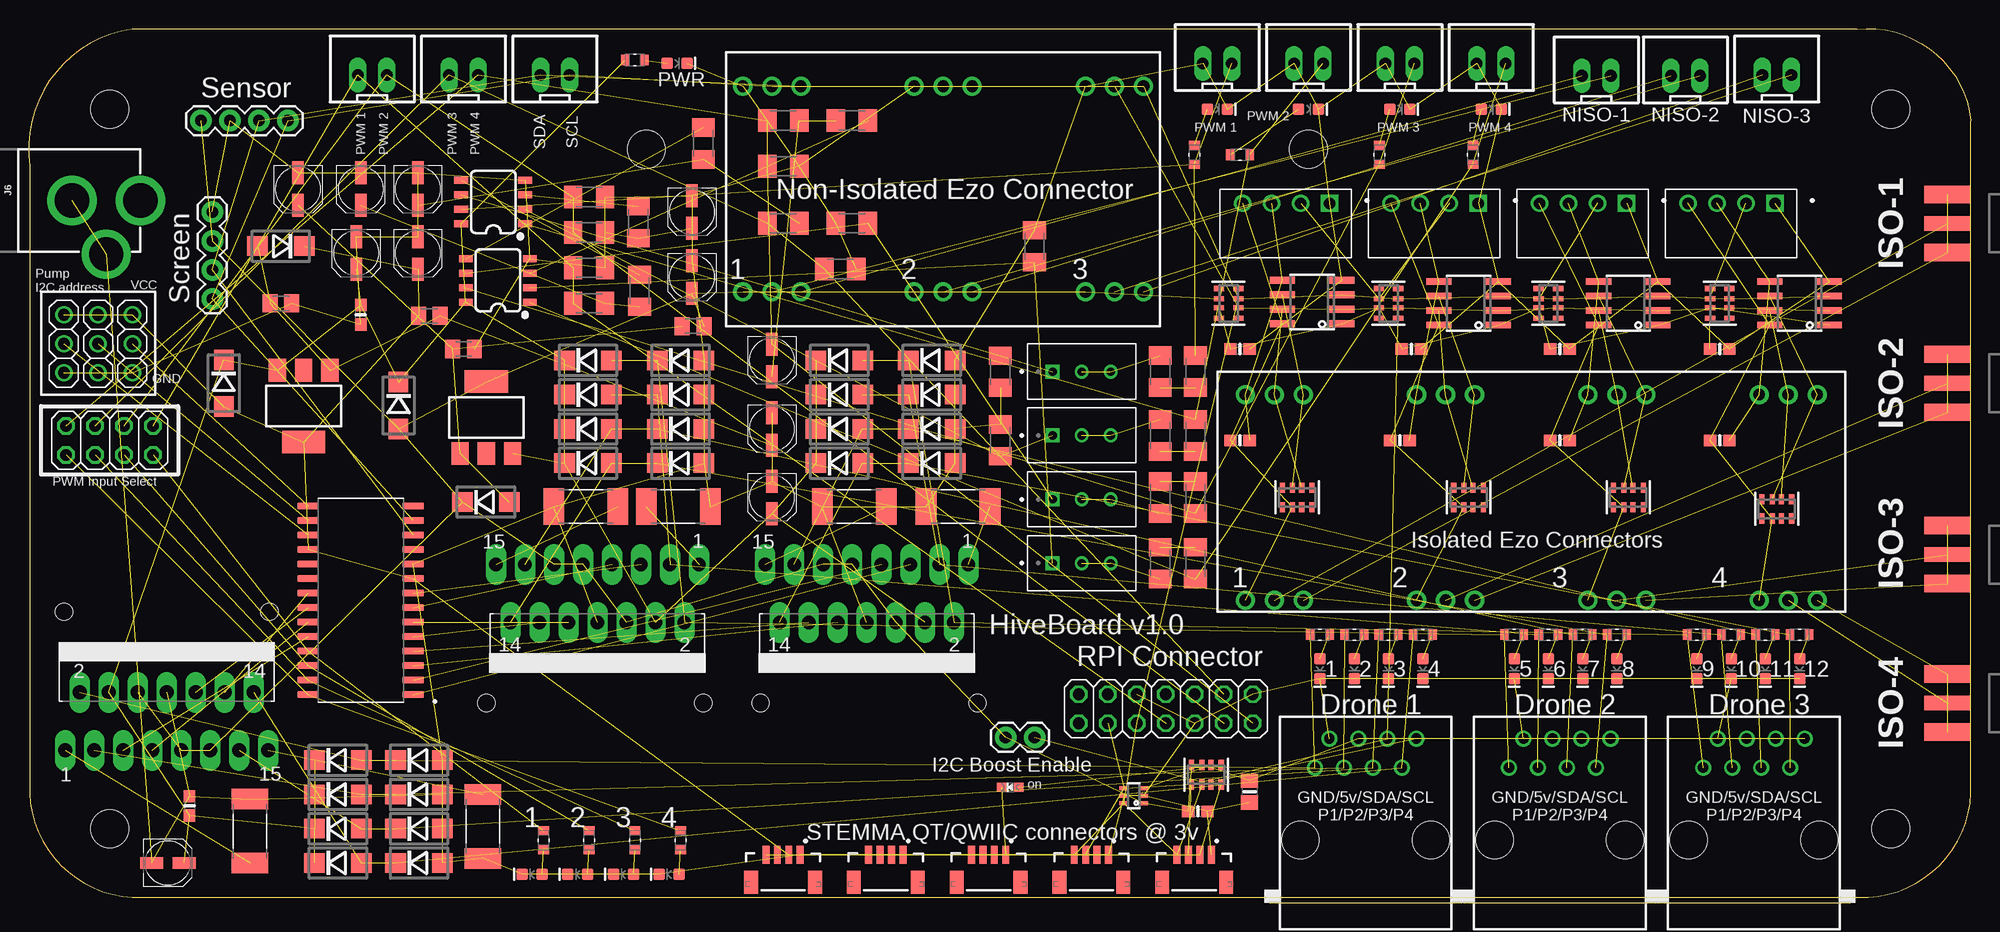
[diagram p2: board, top side]
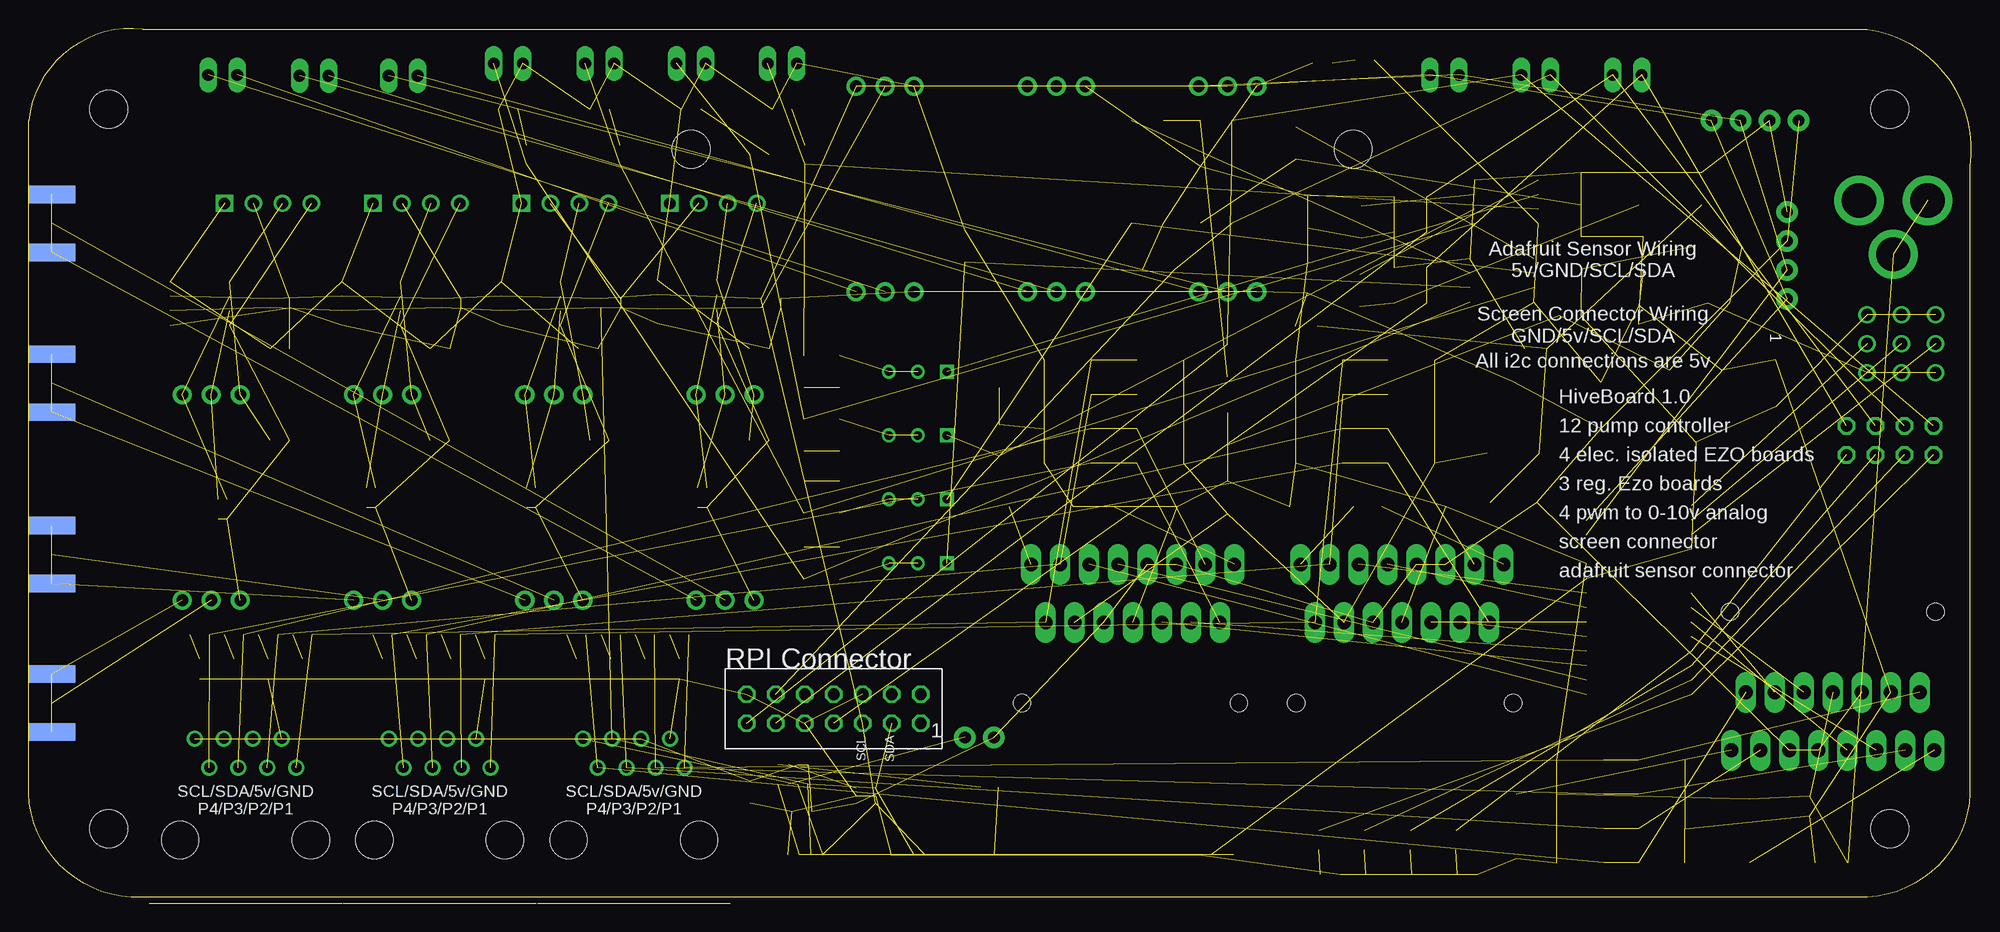
[diagram p3: board, bottom side, seen from below]

Size 170.1 x 76.05 mm. Coordinates in mm from the lower left corner, seen from the top.
Outline: 9.1,0 161.1,0 arc90 170.1,10 170.1,68 arc90 160.1,76 9.1,76 arc90 0.1,64 0.1,10 arc90 9.1,0
Copper layers (1+2*15+16): Top 0.035mm / dielectric 1.5mm / Route2 0.035mm / dielectric 0.15mm / Route15 0.035mm / dielectric 0.2mm / Bottom 0.035mm
Design rules "default *": minimum track width 6mil, minimum drill 0.35mm, track to track 6mil, track to pad 6mil, pad to pad 6mil, via to via 6mil, smd to smd 6mil, copper to edge 40mil, drill to drill 6mil, minimum pad ring 10mil, minimum via ring 8mil, stop-mask expansion 4mil, vias tented up to drill 0mil, thermal gap 10mil
Holes 1.5 mm at 40.1,17 59.1,17 64.1,17 83.1,17 21.1,25 3.1,25

### Footprints (pad centres in the part's own frame; a part is rotated, then mirrored left to right if it is on the bottom)
RESC1608X60N = smd 0.762 x 0.94: 1 -0.838,0; 2 0.838,0
JST-XH-02-PACKAGE-LONG-PAD = drill 1.016 long: 1 -1.27,0; 2 1.27,0
UD-4X5,8_NICHICON = smd 2 x 1: + 1.425,0; - -1.425,0
0603-NO = smd 1.075 x 1: 1 -0.85,0; 2 0.85,0
0805-NO = smd 1.24 x 1.5: 1 -0.95,0; 2 0.95,0
DO214BA = smd 1.8 x 1.7: A 2.05,0; C -2.05,0
CHIPLED_0603_NOOUTLINE = smd 0.8 x 0.8: A 0,-0.75; C 0,0.75
STAND-OFF = hole 3.302: 0,0
MULTIWATT-15 = drill 1.2 long: 1 -8.89,-7.62; 2 -7.62,-2.54; 3 -6.35,-7.62; 4 -5.08,-2.54; 5 -3.81,-7.62; 6 -2.54,-2.54; 7 -1.27,-7.62; 8 0,-2.54; 9 1.27,-7.62; 10 2.54,-2.54; 11 3.81,-7.62; 12 5.08,-2.54; 13 6.35,-7.62; 14 7.62,-2.54; 15 8.89,-7.62
SOT223 = smd 1.5 x 2: 1 -2.3,-3.15; 2 0,-3.15; 3 2.3,-3.15 | smd 3.8 x 2: 4 0,3.15
SC70-6L = smd 0.35 x 0.8: 1 -0.65,-0.85; 2 0,-0.85; 3 0.65,-0.85; 4 0.65,0.85; 5 0,0.85; 6 -0.65,0.85
1X04 = drill 1.016 pad 1.88: 1 0,0; 2 2.54,0; 3 5.08,0; 4 7.62,0
JST04_1MM_VERT = smd 0.6 x 1.55: 1 -1.478,0.775; 2 -0.478,0.775; 3 0.522,0.775; 4 1.522,0.775 | smd 1.2 x 2: NC1 -2.778,3.2; NC2 2.822,3.2
POWER_JACK_PTH = drill 2.997 pad 4.318: GND 0,7.7; GNDBREAK 4.7,10.7; PWR 0,13.7
1X03-CLEANBIG = drill 1.016 pad 1.676: 1 -2.54,0; 2 0,0; 3 2.54,0
2X07 = drill 1.016 octagon: 1 -7.62,-1.27; 2 -7.62,1.27; 3 -5.08,-1.27; 4 -5.08,1.27; 5 -2.54,-1.27; 6 -2.54,1.27; 7 0,-1.27; 8 0,1.27; 9 2.54,-1.27; 10 2.54,1.27; 11 5.08,-1.27; 12 5.08,1.27; 13 7.62,-1.27; 14 7.62,1.27
1X02 = drill 1.016 pad 1.88: 1 0,0; 2 2.54,0
2X04 = drill 1.016 octagon: 1 -3.81,-1.27; 2 -3.81,1.27; 3 -1.27,-1.27; 4 -1.27,1.27; 5 1.27,-1.27; 6 1.27,1.27; 7 3.81,-1.27; 8 3.81,1.27
LED-0603 = smd 1 x 1: A -0.877,0; C 0.877,0
CONV_RFM-0505S = drill 1 square: 1 -3.85,-1.75 | drill 1: 2 -1.31,-1.75; 3 1.23,-1.75; 4 3.77,-1.75
RJ45-NO-SHIELD = drill 0.9 pad 1.4: 1 -4.445,6.35; 2 -3.175,8.89; 3 -1.905,6.35; 4 -0.635,8.89; 5 0.635,6.35; 6 1.905,8.89; 7 3.175,6.35; 8 4.445,8.89 | hole 3.251: -5.715,0; 5.715,0
R2512 = smd 1.8 x 3.2: 1 -2.8,0; 2 2.8,0
M1206 = smd 1.6 x 2: 1 -1.4,0; 2 1.4,0
TRIM_3296W-1-103 = drill 0.71 square: 1 -2.54,0 | drill 0.71: 2 0,0; 3 2.54,0
RESPACK_4X0603 = smd 0.45 x 0.9: 1 -1.3,-0.85; 2 -0.4,-0.85; 3 0.4,-0.85; 4 1.3,-0.85; 5 1.3,0.85; 6 0.4,0.85; 7 -0.4,0.85; 8 -1.3,0.85
M0805 = smd 1.3 x 1.6: 1 -0.95,0; 2 0.95,0
1X03 = drill 1.016: 1 -2.54,0; 2 0,0; 3 2.54,0
SO08 = smd 0.6 x 1.2: 1 -1.905,-2.8; 2 -0.635,-2.8; 3 0.635,-2.8; 4 1.905,-2.8; 5 1.905,2.8; 6 0.635,2.8; 7 -0.635,2.8; 8 -1.905,2.8
SOIC127P1030X265-28N = smd 1.9 x 0.6: 1 -4.605,8.255; 2 -4.605,6.985; 3 -4.605,5.715; 4 -4.605,4.445; 5 -4.605,3.175; 6 -4.605,1.905; 7 -4.605,0.635; 8 -4.605,-0.635; 9 -4.605,-1.905; 10 -4.605,-3.175; 11 -4.605,-4.445; 12 -4.605,-5.715; 13 -4.605,-6.985; 14 -4.605,-8.255; 15 4.605,-8.255; 16 4.605,-6.985; 17 4.605,-5.715; 18 4.605,-4.445; 19 4.605,-3.175; 20 4.605,-1.905; 21 4.605,-0.635; 22 4.605,0.635; 23 4.605,1.905; 24 4.605,3.175; 25 4.605,4.445; 26 4.605,5.715; 27 4.605,6.985; 28 4.605,8.255
SMA_EDGELAUNCH = smd 4.064 x 1.524: GND@1 2.032,-2.54; GND@2 2.032,2.54 | smd 4.064 x 1.524 bottom: GND@3 2.032,2.54; GND@4 2.032,-2.54 | smd 4.064 x 1.27: P 2.032,0
SOIC8_150MIL = smd 0.6 x 2.2: 1 -1.905,-2.6; 2 -0.635,-2.6; 3 0.635,-2.6; 4 1.905,-2.6; 5 1.905,2.6; 6 0.635,2.6; 7 -0.635,2.6; 8 -1.905,2.6

### Placement (x,y rotation side)
12V  53.1,73.3 0 top
(0-10V)-1  112.1,73 0 top
(0-10V)-2  128.1,73 0 top
C1  12.2,3 0 top
C1A1  29.1,62 270 top
C1A2  34.1,62 270 top
C1B1  58.1,60 270 top
C1B2  65.1,47 270 top
C2  28.7,56.4 270 top
C3  65.1,35 270 top
C4  120.1,40 0 top
C5  121.1,48 0 top
C6  106.1,40 0 top
C7  106.1,48 0 top
C8  134.1,40 0 top
C9  134.1,48 0 top
C10  148.1,40 0 top
C11  148.1,48 0 top
C13  34.1,56.4 270 top
C14  65.1,41 270 top
C15  29.1,51 90 top
C16  58.1,54.3 270 top
C17  23.6,62 270 top
C18  14.1,8 270 top
C20  106.92,9.24 270 top
C21  102.4,7.52 0 top
D1  27.1,12 0 top
D2  27.1,9 0 top
D3  27.1,6 0 top
D4  27.1,3 0 top
D5  34.2,12 0 top
D6  34.2,9 0 top
D7  34.2,6 0 top
D8  34.2,3 0 top
D9  49,47 0 top
D10  49,44 0 top
D11  49,41 0 top
D12  49,38 0 top
D13  57.1,47 0 top
D14  57.1,44 0 top
D15  57.1,41 0 top
D16  57.1,38 0 top
D17  71,47 0 top
D18  71,44 0 top
D19  71,41 0 top
D20  71,38 0 top
D21  79.1,47 0 top
D22  79.1,44 0 top
D23  79.1,41 0 top
D24  79.1,38 0 top
D26  85.97,9.64 90 top
D33  32.4,43.05 270 top
D34  40.05,34.6 0 top
D35  22.1,57 180 top
D36  17.1,45 270 top
H5  7.1,69 0 top
H6  7.1,6 0 top
H7  163.1,6 0 top
H8  163.1,69 0 top
IC1  12.1,20.48 0 top
IC2  49.82,21.52 180 top
IC3  73.41,21.52 180 top
IC4  24.1,43 180 top
IC5  40.1,42 0 top
IC7  96.8,8.89 90 top
J2  15.1,68 0 top
J3  16.1,60 270 top
J4  66.1,4.5 180 top
J5  75.1,4.5 180 top
J6  -3.9,61 270 top
J7  84.1,4.5 180 top
J8  93.1,4.5 180 top
J9  102.1,4.5 180 top
JP1  80.1,53 0 top
JP2  65.1,53 0 top
JP3  80.1,71 180 top
JP4  65.1,71 180 top
JP5  95.1,53 0 top
JP6  95.1,71 180 top
JP7  109.1,44 180 top
JP8  109.1,26 0 top
JP9  124.1,44 180 top
JP10  124.1,26 0 top
JP11  139.1,44 180 top
JP12  139.1,26 0 top
JP13  154.1,44 180 top
JP14  154.1,26 0 top
JP15  99.6,16.5 0 top
JP16  88.1,14 180 top
JP19  7.1,40 180 top
LED4  56.8,73 0 top
LED7  113.1,20 270 top
LED8  116.1,20 270 top
LED9  119.1,20 270 top
LED10  122.1,20 270 top
LED11  130.1,20 270 top
LED12  133.1,20 270 top
LED13  136.1,20 270 top
LED14  139.1,20 270 top
LED15  146.1,20 270 top
LED16  149.1,20 270 top
LED17  152.1,20 270 top
LED18  155.1,20 270 top
LED19  104.1,69 0 top
LED20  44.1,2 180 top
LED21  112.1,69 0 top
LED22  120.1,69 0 top
LED23  48.1,2 180 top
LED24  128.1,69 0 top
LED25  52.1,2 180 top
LED27  56.1,2 180 top
PS1  110.1,59 180 top
PS2  123.1,59 180 top
PS3  136.1,59 180 top
PS4  149.1,59 180 top
PUMPBOX-1  117.1,5 0 top
PUMPBOX-2  134.1,5 0 top
PUMPBOX-3  151.1,5 0 top
R1  39.8,6.2 90 top
R1A1  49.1,52 180 top
R1A2  66.1,59 180 top
R1B1  49.1,58.2 0 top
R1B2  66.1,68 0 top
R2  19.4,5.8 270 top
R2A1  85.1,46 90 top
R2A2  72.1,59 0 top
R2B1  85.1,40 90 top
R2B2  88.1,57 90 top
R3  48.8,34.2 0 top
R3-1A1  92.23,46.02 0 top
R3-1A2  92.23,34.84 0 top
R3-1B1  92.23,40.43 0 top
R3-1B2  92.23,29.25 0 top
R3-2A1  99.1,46.02 270 top
R3-2A2  99.1,35 90 top
R3-2B1  99.1,40.43 270 top
R3-2B2  99.1,29.25 90 top
R3-3A1  102.2,46.02 90 top
R3-3A2  102.2,35 270 top
R3-3B1  102.2,40.43 90 top
R3-3B2  102.2,29.25 270 top
R4  56.9,34.2 180 top
R4A1  53.5,53.1 90 top
R4A2  59.1,66 90 top
R4B1  53.4,59.1 90 top
R4B2  72.1,68 0 top
R5  72.3,34.2 0 top
R5A1  49.1,55.1 0 top
R5A2  71.1,55 0 top
R5B1  49.1,61.3 0 top
R5B2  66.1,64 0 top
R6  81.4,34.2 0 top
R7  119.1,52 90 top
R8  126.1,35 180 top
R9  105.1,52 90 top
R10  111.1,35 180 top
R11  133.1,52 90 top
R12  140.1,35 180 top
R13  148.1,52 90 top
R14  153.1,34 180 top
R15  35.1,50.9 180 top
R16  22.1,52 180 top
R17  58.2,50 0 top
R18  38.1,48 180 top
R20  113.1,23 0 top
R21  116.1,23 0 top
R22  119.1,23 0 top
R23  122.1,23 0 top
R24  130.1,23 0 top
R25  133.1,23 0 top
R26  136.1,23 0 top
R27  139.1,23 0 top
R28  146.1,23 0 top
R29  149.1,23 0 top
R30  152.1,23 0 top
R31  155.1,23 0 top
R32  102.1,65 90 top
R33  45.1,5 270 top
R34  106.1,65 180 top
R35  118.3,65 90 top
R36  49.1,5 270 top
R37  126.5,65 90 top
R38  53.1,5 270 top
R39  103.15,10.73 0 top
R40  57.1,5 270 top
SJ1  3.1,48.46 90 top
SJ2  6.1,48.46 90 top
SJ3  9.1,48.46 90 top
U1  41.1,54 90 top
U2  40.69,60.87 90 top
U3  29.1,26 180 top
U$1  [STAND-OFF]  54.1,65.5 0 top
U$2  [STAND-OFF]  112.1,65.5 0 top
X1  170.1,59 180 top
X2  170.1,45 180 top
X3  120.1,73 0 top
X4  104.1,73 0 top
X5  30.1,72 0 top
X6  170.1,30 180 top
X7  170.1,17 180 top
X8  38.1,72 0 top
X11  145.1,71.92 0 top
X12  137.3,71.92 0 top
X13  112.4,52.11 90 top
X14  126.1,52 90 top
X16  140.1,52 90 top
X18  155.1,52 90 top
X20  153.1,72 0 top
X21  46.1,72 0 top

### Tracks (layer width: path | path; a pad name or v marks a point on that pad's centre or on a via)
+3.3V  (15 unrouted)
+5V  (47 unrouted)
+12V  (26 unrouted)
EN  (1 unrouted)
GND  (108 unrouted)
  pour Top (isolate 0.813): 145.1,0 145.1,-1 170.1,42
IN-PUMP-1  (1 unrouted)
IN-PUMP-2  (1 unrouted)
IN-PUMP-3  (1 unrouted)
IN-PUMP-4  (1 unrouted)
IN-PUMP-5  (1 unrouted)
IN-PUMP-6  (1 unrouted)
IN-PUMP-7  (1 unrouted)
IN-PUMP-8  (1 unrouted)
IN-PUMP-9  (1 unrouted)
IN-PUMP-10  (1 unrouted)
IN-PUMP-11  (1 unrouted)
IN-PUMP-12  (1 unrouted)
IN-PWM-1  (4 unrouted)
IN-PWM-2  (4 unrouted)
IN-PWM-3  (4 unrouted)
IN-PWM-4  (5 unrouted)
ISO-1-5V  (5 unrouted)
ISO-2-5V  (5 unrouted)
ISO-3-5V  (5 unrouted)
ISO-4-5V  (5 unrouted)
ISO-GND-1  (3 unrouted)
ISO-GND-2  (3 unrouted)
ISO-GND-3  (3 unrouted)
ISO-GND-4  (3 unrouted)
LED1  (2 unrouted)
LED2  (2 unrouted)
LED3  (2 unrouted)
LED4  (2 unrouted)
N$1  (1 unrouted)
N$2  (1 unrouted)
N$3  (1 unrouted)
N$4  (1 unrouted)
N$5  (4 unrouted)
N$6  (2 unrouted)
N$7  (1 unrouted)
N$8  (1 unrouted)
N$9  (1 unrouted)
N$10  (1 unrouted)
N$11  (4 unrouted)
N$12  (4 unrouted)
N$13  (1 unrouted)
N$14  (4 unrouted)
N$15  (4 unrouted)
N$16  (1 unrouted)
N$17  (2 unrouted)
N$18  (1 unrouted)
N$19  (2 unrouted)
N$20  (1 unrouted)
N$21  (2 unrouted)
N$22  (2 unrouted)
N$23  (2 unrouted)
N$24  (2 unrouted)
N$25  (1 unrouted)
N$26  (1 unrouted)
N$27  (2 unrouted)
N$28  (1 unrouted)
N$29  (1 unrouted)
N$30  (4 unrouted)
N$31  (1 unrouted)
N$32  (1 unrouted)
N$33  (1 unrouted)
N$34  (1 unrouted)
N$35  (1 unrouted)
N$36  (1 unrouted)
N$37  (1 unrouted)
N$38  (1 unrouted)
N$40  (1 unrouted)
N$41  (1 unrouted)
N$42  (1 unrouted)
N$47  (1 unrouted)
N$50  (1 unrouted)
N$51  (1 unrouted)
N$52  (1 unrouted)
N$53  (1 unrouted)
N$54  (1 unrouted)
N$55  (1 unrouted)
N$56  (1 unrouted)
N$57  (1 unrouted)
N$58  (1 unrouted)
N$59  (1 unrouted)
N$60  (1 unrouted)
N$61  (1 unrouted)
N$62  (1 unrouted)
N$63  (2 unrouted)
N$64  (1 unrouted)
N$65  (1 unrouted)
N$66  (1 unrouted)
N$67  (1 unrouted)
N$68  (2 unrouted)
N$70  (2 unrouted)
N$71  (2 unrouted)
N$72  (1 unrouted)
N$73  (1 unrouted)
N$74  (1 unrouted)
N$75  (1 unrouted)
N$76  (1 unrouted)
OUT4  (3 unrouted)
OUT-PUMP-1  (4 unrouted)
OUT-PUMP-2  (4 unrouted)
OUT-PUMP-3  (4 unrouted)
OUT-PUMP-4  (4 unrouted)
OUT-PUMP-5  (4 unrouted)
OUT-PUMP-6  (4 unrouted)
OUT-PUMP-7  (4 unrouted)
OUT-PUMP-8  (4 unrouted)
OUT-PUMP-9  (4 unrouted)
OUT-PUMP-10  (4 unrouted)
OUT-PUMP-11  (4 unrouted)
OUT-PUMP-12  (4 unrouted)
OUTA  (3 unrouted)
OUTA3  (3 unrouted)
OUTB  (3 unrouted)
SCL  (25 unrouted)
SCL2  (2 unrouted)
SCL3  (2 unrouted)
SCL4  (2 unrouted)
SCL5  (2 unrouted)
SDA  (25 unrouted)
SDA2  (2 unrouted)
SDA3  (2 unrouted)
SDA4  (2 unrouted)
SDA5  (2 unrouted)

### Text on the board
tPlace: ⏚ | PWR | ⏚ | ⏚ | ⏚ | Sensor | NISO-3 | PWM 2 | SDA / SCL | PWM 1 | PWM 3 | PWM 4 | PWM 1 | PWM 2 | PWM 3 | PWM 4 | Non-Isolated Ezo Connector | ISO-1 | 1 | 2 | 3 | Pump / I2C address | VCC | Screen | GND | ISO-2 | PWM Input Select | Isolated Ezo Connectors | ISO-3 | 1 | 2 | 3 | 4 | HiveBoard v1.0 | RPI Connector | 1 | 2 | 3 | 4 | 5 | 6 | 7 | 8 | 9 | 10 | 11 | 12 | ISO-4 | Drone 1 | Drone 2 | Drone 3 | ⏚ | ⏚ | ⏚ | I2C Boost Enable | on | GND/5v/SDA/SCL / P1/P2/P3/P4 | GND/5v/SDA/SCL / P1/P2/P3/P4 | GND/5v/SDA/SCL / P1/P2/P3/P4 | 1 | 2 | 3 | 4 | STEMMA QT/QWIIC connectors @ 3v
bPlace: ⏚ | Adafruit Sensor Wiring / 5v/GND/SCL/SDA / / Screen Connector Wiring / GND/5v/SCL/SDA | 1 | All i2c connections are 5v | HiveBoard 1.0 / 12 pump controller / 4 elec. isolated EZO boards / 3 reg. Ezo boards / 4 pwm to 0-10v analog / screen connector / adafruit sensor connector | RPI Connector | ⏚ | ⏚ | ⏚ | ⏚ | ⏚ | 1 | ⏚ | SDA | SCL | SCL/SDA/5v/GND / P4/P3/P2/P1 | SCL/SDA/5v/GND / P4/P3/P2/P1 | SCL/SDA/5v/GND / P4/P3/P2/P1